# EAGLE design E-Reader (EAGLE 9.7.0)
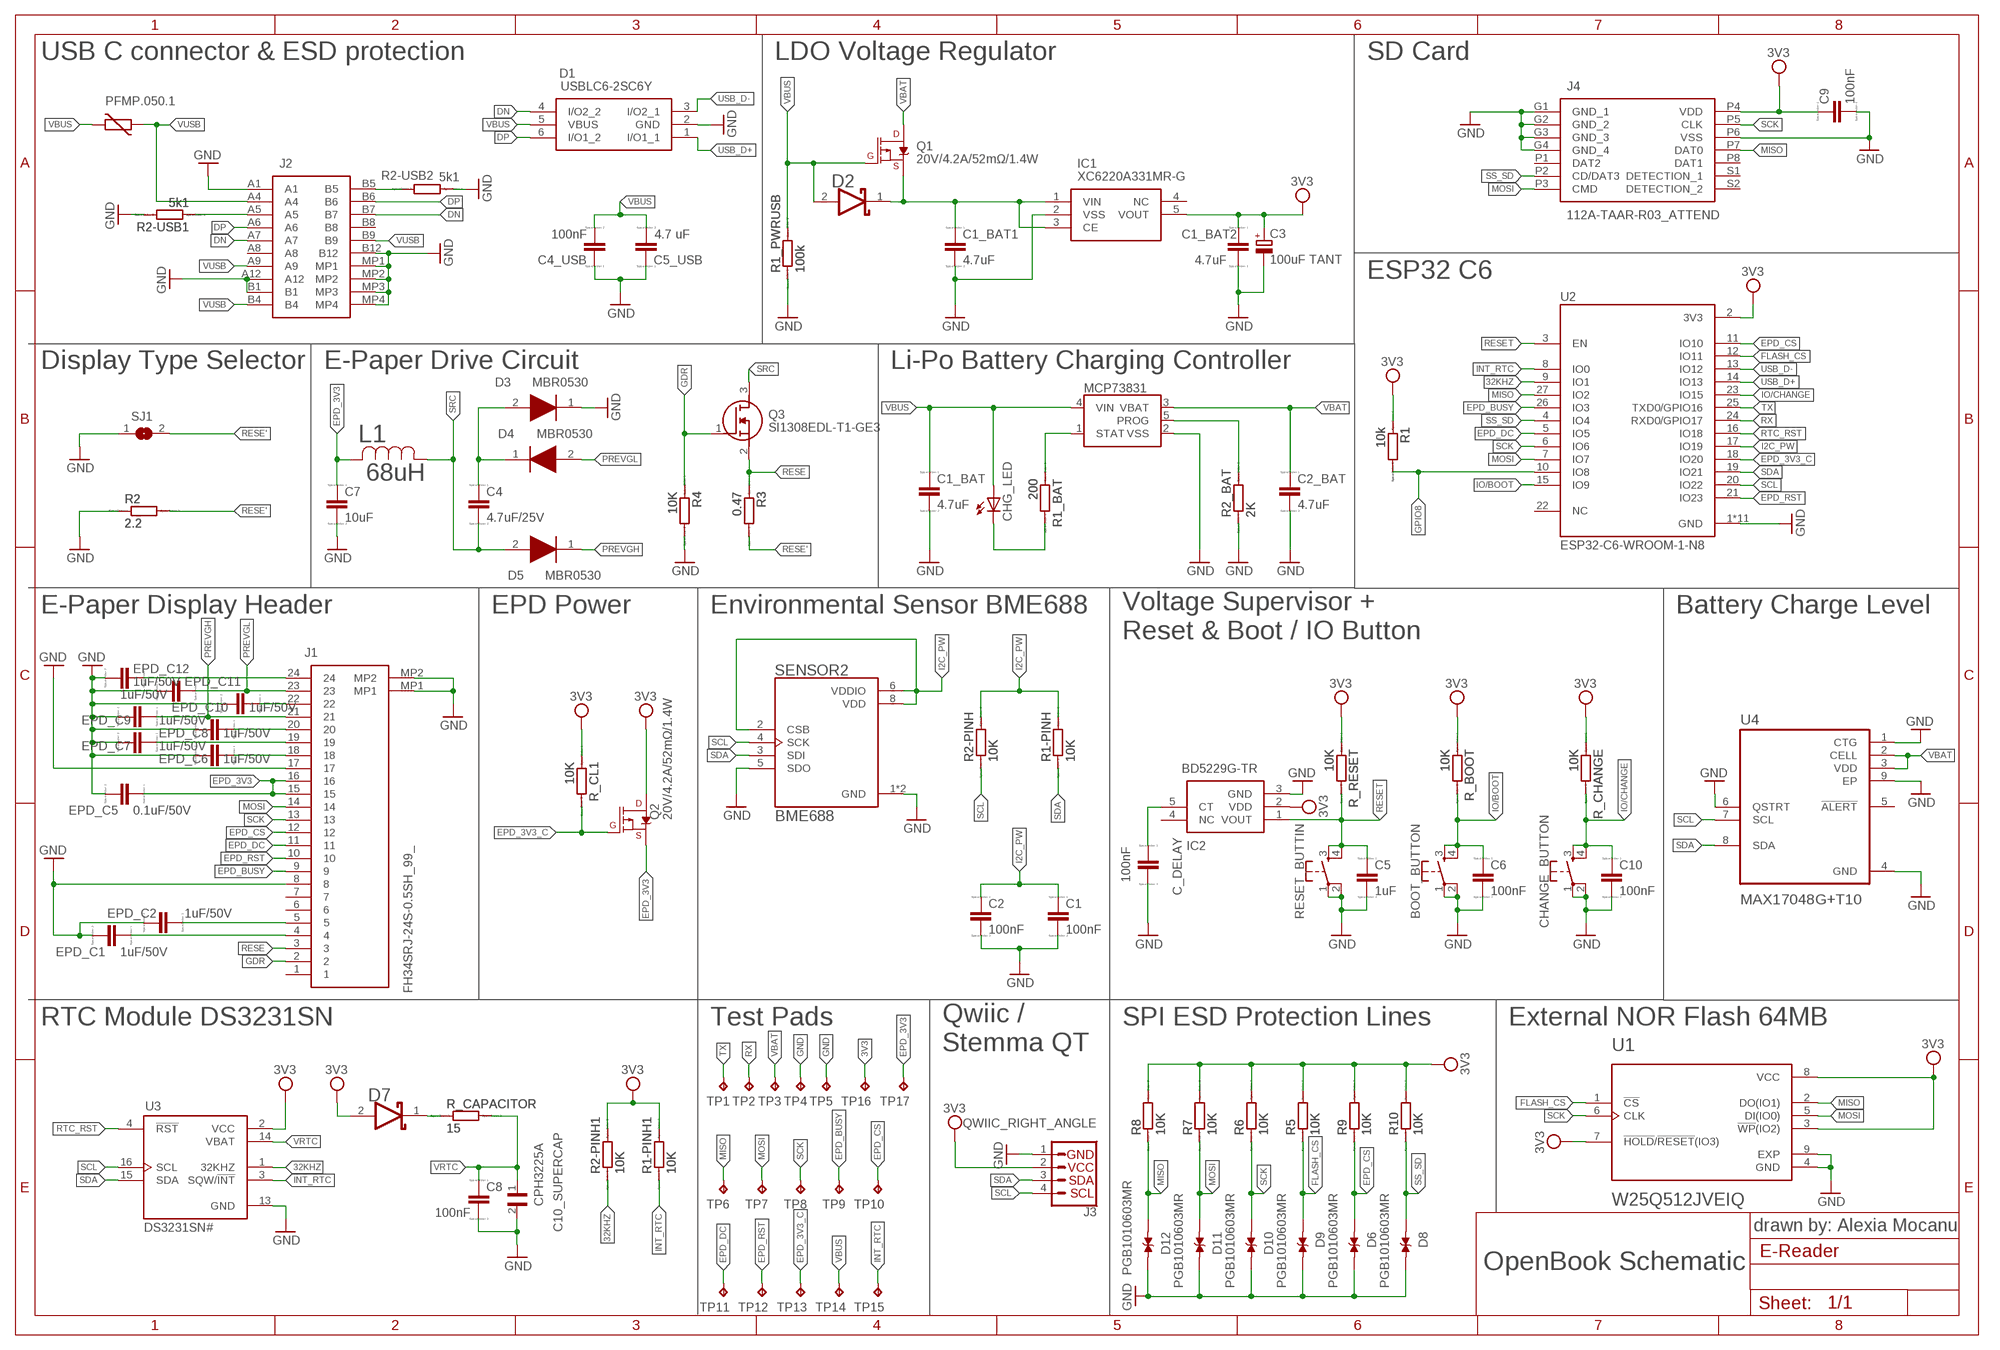
[diagram p0: schematic, sheet 1]

## Parts
BOOT_BUTTON  BUTTON_CUSYOMV1  [MYBUTTON]
C1  100nF  EAGLE-LTSPICE_CC0402  [EAGLE-LTSPICE_C0402]
C1_BAT  4.7uF  EAGLE-LTSPICE_CC0402  [EAGLE-LTSPICE_C0402]
C1_BAT1  4.7uF  EAGLE-LTSPICE_CC0402  [EAGLE-LTSPICE_C0402]
C1_BAT2  4.7uF  EAGLE-LTSPICE_CC0402  [EAGLE-LTSPICE_C0402]
C2  100nF  EAGLE-LTSPICE_CC0402  [EAGLE-LTSPICE_C0402]
C2_BAT  4.7uF  EAGLE-LTSPICE_CC0402  [EAGLE-LTSPICE_C0402]
C3  100uF TANT  RCL_CPOL-EUCT3528  [RCL_CT3528]
C4  4.7uF/25V  EAGLE-LTSPICE_CC0402  [EAGLE-LTSPICE_C0402]
C4_USB  100nF  EAGLE-LTSPICE_CC0402  [EAGLE-LTSPICE_C0402]
C5  1uF  EAGLE-LTSPICE_CC0402  [EAGLE-LTSPICE_C0402]
C5_USB  4.7 uF  EAGLE-LTSPICE_CC0402  [EAGLE-LTSPICE_C0402]
C6  100nF  EAGLE-LTSPICE_CC0402  [EAGLE-LTSPICE_C0402]
C7  10uF  EAGLE-LTSPICE_CC0402  [EAGLE-LTSPICE_C0402]
C8  100nF  EAGLE-LTSPICE_CC0402  [EAGLE-LTSPICE_C0402]
C9  100nF  EAGLE-LTSPICE_CC0402  [EAGLE-LTSPICE_C0402]
C10  100nF  EAGLE-LTSPICE_CC0402  [EAGLE-LTSPICE_C0402]
C10_SUPERCAP  CPH3225A  [CAPCP3225X100N]
C_DELAY  100nF  EAGLE-LTSPICE_CC0402  [EAGLE-LTSPICE_C0402]
CHANGE_BUTTON  BUTTON_CUSYOMV1  [MYBUTTON]
CHG_LED  ADAFRUIT_LEDCHIP-LED0603  [ADAFRUIT_CHIP-LED0603]
D1  USBLC6-2SC6Y  [SOT95P280X145-6N]
D2  ESP32_WROVER_AVX---SD0805S020S1R0_AVX_SD0805S020S1R0_0_0AVX_SD0805S020S1R0_0_0  [ESP32_WROVER_AVX---SD0805S020S1R0_AVX_SD0805S020S1R0_0]
D3  MBR0530  [SOD3716X135N]
D4  MBR0530  [SOD3716X135N]
D5  MBR0530  [SOD3716X135N]
D6  PGB1010603MR  [DIOC1608X36N]
D7  SD0805S020S1R0  ESP32_WROVER_AVX---SD0805S020S1R0_AVX_SD0805S020S1R0_0_0AVX_SD0805S020S1R0_0_0  [ESP32_WROVER_AVX---SD0805S020S1R0_AVX_SD0805S020S1R0_0]
D8  PGB1010603MR  [DIOC1608X36N]
D9  PGB1010603MR  [DIOC1608X36N]
D10  PGB1010603MR  [DIOC1608X36N]
D11  PGB1010603MR  [DIOC1608X36N]
D12  PGB1010603MR  [DIOC1608X36N]
EPD_C1  1uF/50V  EAGLE-LTSPICE_CC0402  [EAGLE-LTSPICE_C0402]
EPD_C2  1uF/50V  EAGLE-LTSPICE_CC0402  [EAGLE-LTSPICE_C0402]
EPD_C5  0.1uF/50V  EAGLE-LTSPICE_CC0402  [EAGLE-LTSPICE_C0402]
EPD_C6  1uF/50V  EAGLE-LTSPICE_CC0402  [EAGLE-LTSPICE_C0402]
EPD_C7  1uF/50V  EAGLE-LTSPICE_CC0402  [EAGLE-LTSPICE_C0402]
EPD_C8  1uF/50V  EAGLE-LTSPICE_CC0402  [EAGLE-LTSPICE_C0402]
EPD_C9  1uF/50V  EAGLE-LTSPICE_CC0402  [EAGLE-LTSPICE_C0402]
EPD_C10  1uF/50V  EAGLE-LTSPICE_CC0402  [EAGLE-LTSPICE_C0402]
EPD_C11  1uF/50V  EAGLE-LTSPICE_CC0402  [EAGLE-LTSPICE_C0402]
EPD_C12  1uF/50V  EAGLE-LTSPICE_CC0402  [EAGLE-LTSPICE_C0402]
IC1  XC6220A331MR-G  [SOT95P280X120-5N]
IC2  BD5229G-TR  [SOT95P280X125-5N]
J1  FH34SRJ-24S-0.5SH_99_  [FH34SRJ24S05SH99]
J2  SAMACSYS_PARTS_USB4110-GF-A  [SAMACSYS_PARTS_USB4110GFA]
J3  QWIIC_RIGHT_ANGLE  QWIIC_CONNECTORJS-1MM  [JST04_1MM_RA]
J4  112A-TAAR-R03_ATTEND  [112ATAARR03ATTEND]
L1  68uH  744043680IND_4828-WE-TPC_WRE  [IND_4828-WE-TPC_WRE]
MCP73831  ESP32_WROVER_SPARKFUN-IC-POWER_MCP73831  [ESP32_WROVER_SPARKFUN-IC-POWER_SOT23-5]
PFMP.050.1  ESP32C6_VARISTORCN1812  [ESP32C6_VARISTOR_CT/CN1812]
Q1  20V/4.2A/52mΩ/1.4W  ESP32_WROVER_SPARKFUN-DISCRETESEMI_MOSFET_PCH-DMG2305UX-7  [ESP32_WROVER_SPARKFUN-DISCRETESEMI_SOT23-3]
Q2  20V/4.2A/52mΩ/1.4W  ESP32_WROVER_SPARKFUN-DISCRETESEMI_MOSFET_PCH-DMG2305UX-7  [ESP32_WROVER_SPARKFUN-DISCRETESEMI_SOT23-3]
Q3  SI1308EDL-T1-GE3  [SOT65P210X110-3N]
R1  10k  ESP32_WROVER_EAGLE-LTSPICE_RR0402  [ESP32_WROVER_EAGLE-LTSPICE_R0402]
R1-PINH  10K  ESP32_WROVER_EAGLE-LTSPICE_RR0402  [ESP32_WROVER_EAGLE-LTSPICE_R0402]
R1-PINH1  10K  ESP32_WROVER_EAGLE-LTSPICE_RR0402  [ESP32_WROVER_EAGLE-LTSPICE_R0402]
R1_BAT  200  ESP32_WROVER_EAGLE-LTSPICE_RR0402  [ESP32_WROVER_EAGLE-LTSPICE_R0402]
R1_PWRUSB  100k  ESP32_WROVER_EAGLE-LTSPICE_RR0402  [ESP32_WROVER_EAGLE-LTSPICE_R0402]
R2  2.2  ESP32_WROVER_EAGLE-LTSPICE_RR0402  [ESP32_WROVER_EAGLE-LTSPICE_R0402]
R2-PINH  10K  ESP32_WROVER_EAGLE-LTSPICE_RR0402  [ESP32_WROVER_EAGLE-LTSPICE_R0402]
R2-PINH1  10K  ESP32_WROVER_EAGLE-LTSPICE_RR0402  [ESP32_WROVER_EAGLE-LTSPICE_R0402]
R2-USB1  5k1  ESP32_WROVER_EAGLE-LTSPICE_RR0402  [ESP32_WROVER_EAGLE-LTSPICE_R0402]
R2-USB2  5k1  ESP32_WROVER_EAGLE-LTSPICE_RR0402  [ESP32_WROVER_EAGLE-LTSPICE_R0402]
R2_BAT  2K  ESP32_WROVER_EAGLE-LTSPICE_RR0402  [ESP32_WROVER_EAGLE-LTSPICE_R0402]
R3  0.47  ESP32_WROVER_EAGLE-LTSPICE_RR0402  [ESP32_WROVER_EAGLE-LTSPICE_R0402]
R4  10K  ESP32_WROVER_EAGLE-LTSPICE_RR0402  [ESP32_WROVER_EAGLE-LTSPICE_R0402]
R5  10K  ESP32_WROVER_EAGLE-LTSPICE_RR0402  [ESP32_WROVER_EAGLE-LTSPICE_R0402]
R6  10K  ESP32_WROVER_EAGLE-LTSPICE_RR0402  [ESP32_WROVER_EAGLE-LTSPICE_R0402]
R7  10K  ESP32_WROVER_EAGLE-LTSPICE_RR0402  [ESP32_WROVER_EAGLE-LTSPICE_R0402]
R8  10K  ESP32_WROVER_EAGLE-LTSPICE_RR0402  [ESP32_WROVER_EAGLE-LTSPICE_R0402]
R9  10K  ESP32_WROVER_EAGLE-LTSPICE_RR0402  [ESP32_WROVER_EAGLE-LTSPICE_R0402]
R10  10K  ESP32_WROVER_EAGLE-LTSPICE_RR0402  [ESP32_WROVER_EAGLE-LTSPICE_R0402]
R_BOOT  10K  ESP32_WROVER_EAGLE-LTSPICE_RR0402  [ESP32_WROVER_EAGLE-LTSPICE_R0402]
R_CAPACITOR  15  ESP32_WROVER_EAGLE-LTSPICE_RR0402  [ESP32_WROVER_EAGLE-LTSPICE_R0402]
R_CHANGE  10K  ESP32_WROVER_EAGLE-LTSPICE_RR0402  [ESP32_WROVER_EAGLE-LTSPICE_R0402]
R_CL1  10K  ESP32_WROVER_EAGLE-LTSPICE_RR0402  [ESP32_WROVER_EAGLE-LTSPICE_R0402]
R_RESET  10K  ESP32_WROVER_EAGLE-LTSPICE_RR0402  [ESP32_WROVER_EAGLE-LTSPICE_R0402]
RESET_BUTTIN  BUTTON_CUSYOMV1  [MYBUTTON]
SENSOR2  BME688  ESP32_WROVER_BME680_BME680  [ESP32_WROVER_BME680_PSON80P300X300X100-8N]
SJ1  SJ  [SJ]
TP1  TPTP20R  [TP20R]
TP2  TPTP20R  [TP20R]
TP3  TPTP20R  [TP20R]
TP4  TPTP20R  [TP20R]
TP5  TPTP20R  [TP20R]
TP6  TPTP20R  [TP20R]
TP7  TPTP20R  [TP20R]
TP8  TPTP20R  [TP20R]
TP9  TPTP20R  [TP20R]
TP10  TPTP20R  [TP20R]
TP11  TPTP20R  [TP20R]
TP12  TPTP20R  [TP20R]
TP13  TPTP20R  [TP20R]
TP14  TPTP20R  [TP20R]
TP15  TPTP20R  [TP20R]
TP16  TPTP20R  [TP20R]
TP17  TPTP20R  [TP20R]
U1  W25Q512JVEIQ  [SON127P600X800X80-9N]
U2  ESP32-C6-WROOM-1-N8  [XCVR_ESP32-C6-WROOM-1-N8]
U3  DS3231SN#  [SOIC127P1032X265-16N]
U4  MAX17048G+T10  [SON50P200X200X80-9N]

## Nets
3V3 [power]: C1_BAT2.1 C3.+ C9.1 D7.2(ANODE) IC1.5(VOUT) IC2.2(VDD) J3.2 J4.P4(VDD) Q2.3(D) R1-PINH1.2 R1.1 R2-PINH1.2 R5.2 R6.2 R7.2 R8.2 R9.2 R10.2 R_BOOT.1 R_CHANGE.1 R_CL1.1 R_RESET.1 TP16.TP U1.3(!WP!(IO2)) U1.7(!HOLD!/!RESET!(IO3)) U1.8(VCC) U2.2(3V3) U3.2(VCC)
32KHZ: R2-PINH1.1 U2.9(IO1) U3.1(32KHZ)
DN: D1.4(I/O2_2) J2.A7 J2.B7
DP: D1.6(I/O1_2) J2.A6 J2.B6
EPD_3V3 [power]: C7.1 EPD_C5.1 J1.15 J1.16 L1.2 Q2.2(S) TP17.TP
EPD_3V3_C [power]: Q2.1(G) R_CL1.2 TP13.TP U2.18(IO20)
EPD_BUSY: J1.9 TP9.TP U2.26(IO3)
EPD_CS: D6.1 J1.12 R9.1 TP10.TP U2.11(IO10)
EPD_DC: J1.11 TP11.TP U2.5(IO5)
EPD_RST: J1.10 TP12.TP U2.21(IO23)
FLASH_CS: D9.1 R5.1 U1.1(!CS) U2.12(IO11)
GDR: J1.2 Q3.1(G) R4.1
GND: BOOT_BUTTON.1 BOOT_BUTTON.2 C1.2 C1_BAT1.2 C1_BAT2.2 C1_BAT.2 C2.2 C2_BAT.2 C3.- C4_USB.1 C5.2 C5_USB.1 C6.2 C7.2 C8.2 C9.2 C10.2 C10_SUPERCAP.2 C_DELAY.2 CHANGE_BUTTON.1 CHANGE_BUTTON.2 D1.2(GND) D3.1(K) D6.2 D8.2 D9.2 D10.2 D11.2 D12.2 EPD_C1.2 EPD_C2.2 EPD_C5.2 EPD_C6.2 EPD_C7.2 EPD_C8.2 EPD_C9.2 EPD_C10.2 EPD_C11.2 EPD_C12.2 IC1.2(VSS) IC2.3(GND) J1.8 J1.17 J1.MP1 J1.MP2 J2.A1 J2.A12 J2.B1 J2.B12 J2.MP1 J2.MP2 J2.MP3 J2.MP4 J3.1 J4.G1(GND_1) J4.G2(GND_2) J4.G3(GND_3) J4.G4(GND_4) J4.P6(VSS) MCP73831.2(VSS) R1_PWRUSB.1 R2-USB1.2 R2-USB2.1 R2.1 R2_BAT.1 R4.2 RESET_BUTTIN.1 RESET_BUTTIN.2 SENSOR2.1(GND) SENSOR2.5(SDO) SENSOR2.7(GND) SJ1.1 TP4.TP TP5.TP U1.4(GND) U1.9(EXP) U2.1(GND) U2.28(GND) U2.29_1(GND) U2.29_2(GND) U2.29_3(GND) U2.29_4(GND) U2.29_5(GND) U2.29_6(GND) U2.29_7(GND) U2.29_8(GND) U2.29_9(GND) U3.13(GND) U4.1(CTG) U4.4(GND) U4.6(QSTRT) U4.9(EP)
GPIO8: R1.2 U2.10(IO8)
I2C_PW [power]: C1.1 C2.1 R1-PINH.2 R2-PINH.2 SENSOR2.2(CSB) SENSOR2.6(VDDIO) SENSOR2.8(VDD) U2.17(IO19)
INT_RTC: R1-PINH1.1 TP15.TP U2.8(IO0) U3.3(SQW/!INT)
IO/BOOT: BOOT_BUTTON.3 BOOT_BUTTON.4 C6.1 R_BOOT.2 U2.15(IO9)
IO/CHANGE: C10.1 CHANGE_BUTTON.3 CHANGE_BUTTON.4 R_CHANGE.2 U2.23(IO15)
MISO: D12.1 J4.P7(DAT0) R8.1 TP6.TP U1.2(DO(IO1)) U2.27(IO2)
MOSI: D11.1 J1.14 J4.P3(CMD) R7.1 TP7.TP U1.5(DI(IO0)) U2.7(IO7)
N$1: C1_BAT1.1 D2.1(CATHODE) IC1.1(VIN) IC1.3(CE) Q1.2(S)
N$2: J2.A5 R2-USB1.1
N$3: EPD_C12.1 J1.24
N$4: C_DELAY.1 IC2.5(CT)
N$5: C4.1 D3.2(A) D4.1(K)
N$6: MCP73831.1(STAT) R1_BAT.1
N$7: CHG_LED.C R1_BAT.2
N$8: J2.B5 R2-USB2.2
N$9: MCP73831.5(PROG) R2_BAT.2
N$10: EPD_C10.1 J1.22
N$12: EPD_C8.1 J1.20
N$13: EPD_C7.1 J1.19
N$14: EPD_C6.1 J1.18
N$16: EPD_C1.1 J1.4
N$17: EPD_C2.1 J1.5
N$22: D7.1(CATHODE) R_CAPACITOR.1
PREVGH: D5.1(K) EPD_C9.1 J1.21
PREVGL: D4.2(A) EPD_C11.1 J1.23
RESE: J1.3 Q3.2(S) R3.1
RESE': R2.2 R3.2 SJ1.2
RESET: C5.1 IC2.1(VOUT) R_RESET.2 RESET_BUTTIN.3 RESET_BUTTIN.4 U2.3(EN)
RTC_RST: U2.16(IO18) U3.4(!RST)
RX: TP2.TP U2.24(RXD0/GPIO17)
SCK: D10.1 J1.13 J4.P5(CLK) R6.1 TP8.TP U1.6(CLK) U2.6(IO6)
SCL: J3.4 R2-PINH.1 SENSOR2.4(SCK) U2.20(IO22) U3.16(SCL) U4.7(SCL)
SDA: J3.3 R1-PINH.1 SENSOR2.3(SDI) U2.19(IO21) U3.15(SDA) U4.8(SDA)
SRC: C4.2 D5.2(A) L1.1 Q3.3(D)
SS_SD: D8.1 J4.P2(CD/DAT3) R10.1 U2.4(IO4)
TX: TP1.TP U2.25(TXD0/GPIO16)
USB_D+: D1.1(I/O1_1) U2.14(IO13)
USB_D-: D1.3(I/O2_1) U2.13(IO12)
VBAT [power]: C2_BAT.1 MCP73831.3(VBAT) Q1.3(D) TP3.TP U4.2(CELL) U4.3(VDD)
VBUS [power]: C1_BAT.1 C4_USB.2 C5_USB.2 CHG_LED.A D1.5(VBUS) D2.2(ANODE) MCP73831.4(VIN) PFMP.050.1.2 Q1.1(G) R1_PWRUSB.2 TP14.TP
VRTC: C8.1 C10_SUPERCAP.1 R_CAPACITOR.2 U3.14(VBAT)
VUSB [power]: J2.A4 J2.A9 J2.B4 J2.B9 PFMP.050.1.1
Unconnected: IC1.4(NC) IC2.4(NC) J1.1 J1.6 J1.7 J2.A8 J2.B8 J4.P1(DAT2) J4.P8(DAT1) J4.S1(DETECTION_1) J4.S2(DETECTION_2) U2.22(NC) U4.5(!ALERT)

## Notes on the sheet
- USB C connector & ESD protection | LDO Voltage Regulator | SD Card
- ESP32 C6
- Display Type Selector | E-Paper Drive Circuit | Li-Po Battery Charging Controller
- E-Paper Display Header | EPD Power | Environmental Sensor BME688 | Battery Charge Level
- Voltage Supervisor +
  Reset & Boot / IO Button
- RTC Module DS3231SN | Test Pads | SPI ESD Protection Lines | External NOR Flash 64MB
- Qwiic /
  Stemma QT
- drawn by: Alexia Mocanu
- OpenBook Schematic

## Library data of the parts
BOOT_BUTTON CHANGE_BUTTON RESET_BUTTIN = DeskAssistant v19 v1.flbr:BUTTON_CUSYOMV1
C1 C1_BAT C1_BAT1 C1_BAT2 C2 C2_BAT C4 C4_USB C5 C5_USB C6-C10 C_DELAY EPD_C1 EPD_C2 EPD_C5-EPD_C12 = DeskAssistant v19 v1.flbr:EAGLE-LTSPICE_C: CAPACITOR, European symbol; SPICEMODEL: NONE; SPICEPREFIX: C
C3 = DeskAssistant v19 v1.flbr:RCL_CPOL-EU: POLARIZED CAPACITOR, European symbol; SPICEPREFIX: C
C10_SUPERCAP = DeskAssistant v19 v1.flbr:CPH3225A: Cap 0.011F 3.3V 1210 Flat Check availability <https://pricing.snapeda.com/parts/CPH3225A/Seiko%20Instruments/view-part?ref=eda>; AVAILABILITY: Not in stock; CHECK_PRICES: https://www.snapeda.com/parts/CPH3225A/Seiko+Instruments/view-part/?ref=eda; DESCRIPTION: 11 mF (EDLC) Supercapacitor 3.3 V 1210 (3225 Metric) - -; MF: Seiko Instruments; MP: CPH3225A; PACKAGE: 1210 Seiko; PRICE: None; PURCHASE-URL: https://www.snapeda.com/api/url_track_click_mouser/?unipart_id=562593&manufacturer=Seiko Instruments&part_name=CPH3225A&search_term=None; SNAPEDA_LINK: https://www.snapeda.com/parts/CPH3225A/Seiko+Instruments/view-part/?ref=snap
CHG_LED = DeskAssistant v19 v1.flbr:ADAFRUIT_LED: LED OSRAM: - CHIPLED LG R971, LG N971, LY N971, LG Q971, LY Q971, LO R971, LY R971 LH N974, LH R974 LS Q976, LO Q976, LY Q976 LO Q996 - Hyper CHIPLED LW Q18S LB Q993, LB Q99A, LB R99A - SideLED LS A670, LO A670, LY A670, LG A670, LP A670 LB A673, LV A673, LT A673, LW A673 LH A674 LY A675 LS A676, LA A676, LO A676, LY A676, LW A676 LS A679, LY A679, LG A679 - Hyper Micro SIDELED® LS Y876, LA Y876, LO Y876, LY Y876 LT Y87S - SmartLED LW L88C, LW L88S LB L89C, LB L89S, LG L890 LS L89K, LO L89K, LY L89K LS L896, LA L896, LO L896, LY L896 - TOPLED LS T670, LO T670, LY T670, LG T670, LP T670 LSG T670, LSP T670, LSY T670, LOP T670, LYG T670 LG T671, LOG T671, LSG T671 LB T673, LV T673, LT T673, LW T673 LH T674 LS T676, LA T676, LO T676, LY T676, LB T676, LH T676, LSB T676, LW T676 LB T67C, LV T67C, LT T67C, LS T67K, LO T67K, LY T67K, LW E67C LS E67B, LA E67B, LO E67B, LY E67B, LB E67C, LV E67C, LT E67C LW T67C LS T679, LY T679, LG T679 LS T770, LO T770, LY T770, LG T770, LP T770 LB T773, LV T773, LT T773, LW T773 LH T774 LS E675, LA E675, LY E675, LS T675 LS T776, LA T776, LO T776, LY T776, LB T776 LHGB T686 LT T68C, LB T68C - Hyper Mini TOPLED® LB M676 - Mini TOPLED Santana® LG M470 LS M47K, LO M47K, LY M47K Source: http://www.osram.convergy.de/
D1 = DeskAssistant v19 v1.flbr:USBLC6-2SC6Y: Low Cap. ESD Protection Auto SOT-23-6 STMicroelectronics USBLC6-2SC6Y, Dual Uni-Directional TVS Diode Array, 6-Pin SOT-23 Source: Datasheet <https://componentsearchengine.com/Datasheets/1/USBLC6-2SC6Y.pdf> Check availability <https://pricing.snapeda.com/parts/USBLC6-2SC6Y/STMicroelectronics/view-part?ref=eda>; AVAILABILITY: In Stock; CHECK_PRICES: https://www.snapeda.com/parts/USBLC6-2SC6Y/STMicroelectronics/view-part/?ref=eda; DESCRIPTION: 17V Clamp 5A (8/20µs) Ipp Tvs Diode Surface Mount SOT-23-6; MF: STMicroelectronics; MP: USBLC6-2SC6Y; PACKAGE: SOT-23-6 STMicroelectronics; PRICE: None; SNAPEDA_LINK: https://www.snapeda.com/parts/USBLC6-2SC6Y/STMicroelectronics/view-part/?ref=snap
D2 D7 = DeskAssistant v19 v1.flbr:ESP32_WROVER_AVX---SD0805S020S1R0_AVX_SD0805S020S1R0_0_0: Schottky Barrier Rectifier Diode; CENTROID_NOT_SPECIFIED: No; DATASHEET: http://datasheets.avx.com/schottky.pdf; DIGIKEY_DESCRIPTION: DIODE SCHOTTKY 20V 1A 0805; DIGIKEY_PART_NUMBER: 478-7800-1-ND; LEAD_FREE: yes; MF: AVX; MOUSER_PART_NUMBER: 581-SD0805S020S1R0; PACKAGE: 0805 (2012 metric); PREFIX: D; ROHS: yes; TEMPERATURE_RANGE_HIGH: +125°C; TEMPERATURE_RANGE_LOW: -55°C
D3-D5 = DeskAssistant v19 v1.flbr:MBR0530: ON SEMICONDUCTOR - MBR0530 - DIODE, SCHOTTKY, 0.5A, 30V, SOD-123 Source: Datasheet <http://www.onsemi.com/pub/Collateral/MBR0530T1-D.PDF> Check availability <https://pricing.snapeda.com/parts/MBR0530/ON%20Semiconductor/view-part?ref=eda>; AVAILABILITY: In Stock; CHECK_PRICES: https://www.snapeda.com/parts/MBR0530/Onsemi/view-part/?ref=eda; DESCRIPTION: Diode Schottky 30 V 500mA Surface Mount SOD-123; MF: ON Semiconductor; MP: MBR0530; PACKAGE: SOD-123-2 ON Semiconductor; PRICE: None; PURCHASE-URL: https://www.snapeda.com/api/url_track_click_mouser/?unipart_id=179458&manufacturer=ON Semiconductor&part_name=MBR0530&search_term=None; SNAPEDA_LINK: https://www.snapeda.com/parts/MBR0530/Onsemi/view-part/?ref=snap
D6 D8-D12 = DeskAssistant v19 v1.flbr:PGB1010603MR: Check availability <https://pricing.snapeda.com/parts/PGB1010603MR/Littelfuse%20Inc./view-part?ref=eda>; AVAILABILITY: In Stock; CHECK_PRICES: https://www.snapeda.com/parts/PGB1010603MR/Littelfuse/view-part/?ref=eda; DESCRIPTION: 150V (Typ) Clamp - Ipp Tvs Diode Surface Mount 0603 (1608 Metric); MF: Littelfuse Inc.; MP: PGB1010603MR; PACKAGE: 0603 Littelfuse Inc.; PRICE: None; PURCHASE-URL: https://www.snapeda.com/api/url_track_click_mouser/?unipart_id=5659453&manufacturer=Littelfuse Inc.&part_name=PGB1010603MR&search_term=None; SNAPEDA_LINK: https://www.snapeda.com/parts/PGB1010603MR/Littelfuse/view-part/?ref=snap
IC1 = DeskAssistant v19 v1.flbr:XC6220A331MR-G: LDO Voltage Regulators Source: Datasheet <https://www.torexsemi.com/file/xc6220/XC6220.pdf>; DESCRIPTION: LDO Voltage Regulators; HEIGHT: 1.2mm; MANUFACTURER_NAME: Torex; MANUFACTURER_PART_NUMBER: XC6220A331MR-G; MOUSER_PART_NUMBER: 865-XC6220A331MR-G; MOUSER_PRICE-STOCK: https://www.mouser.co.uk/ProductDetail/Torex-Semiconductor/XC6220A331MR-G?qs=AsjdqWjXhJ8ZSWznL1J0gg%3D%3D
IC2 = DeskAssistant v19 v1.flbr:BD5229G-TR: Voltage Detector with Adjustable Delay Time: CMOS processes are utilized to develop high precision, low current consumption CMOS reset ICs that allow arbitrary setting of the delay time. The extensive lineup includes both Nch Open Drain and CMOS output types in a wide range of detection voltages (from 2.3V to 6.0V, in 0.1V steps), enabling selection of the ideal solution based on customer requirements. In addition, the entire series is of course both lead-free and RoHS-compliant. Source: Datasheet <https://datasheet.datasheetarchive.com/originals/distributors/Datasheets_SAMA/f2b9741ef86007909f138d561a359946.pdf>; DESCRIPTION: Voltage Detector with Adjustable Delay Time: CMOS processes are utilized to develop high precision, low current consumption CMOS reset ICs that allow arbitrary setting of the delay time. The extensive lineup includes both Nch Open Drain and CMOS output types in a wide range of detection voltages (from 2.3V to 6.0V, in 0.1V steps), enabling selection of the ideal solution based on customer requirements. In addition, the entire series is of course both lead-free and RoHS-compliant.; HEIGHT: 1.25mm; MANUFACTURER_NAME: ROHM Semiconductor; MANUFACTURER_PART_NUMBER: BD5229G-TR; MOUSER_PART_NUMBER: 755-BD5229G-TR; MOUSER_PRICE-STOCK: https://www.mouser.co.uk/ProductDetail/ROHM-Semiconductor/BD5229G-TR?qs=4kLU8WoGk0vvnhrrYwdszw%3D%3D
J1 = DeskAssistant v19 v1.flbr:FH34SRJ-24S-0.5SH_99_: 24 Position FFC, FPC Connector Contacts, Top and Bottom 0.020" (0.50mm) Surface Mount, Right Angle Source: Datasheet <https://www.hirose.com/en/product/document?clcode=CL0580-1255-6-99&productname=FH34SRJ-24S-0.5SH(99)&series=FH34SRJ&documenttype=2DDrawing&lang=en&documentid=0000990903>; DESCRIPTION: 24 Position FFC, FPC Connector Contacts, Top and Bottom 0.020" (0.50mm) Surface Mount, Right Angle; HEIGHT: 1.1mm; MANUFACTURER_NAME: Hirose; MANUFACTURER_PART_NUMBER: FH34SRJ-24S-0.5SH(99); MOUSER_PART_NUMBER: 798-FH34SRJ24S05SH99; MOUSER_PRICE-STOCK: https://www.mouser.co.uk/ProductDetail/Hirose-Connector/FH34SRJ-24S-0.5SH99?qs=vcbW%252B4%252BSTIpKBl5ap9J8Fw%3D%3D
J2 = DeskAssistant v19 v1.flbr:SAMACSYS_PARTS_USB4110-GF-A: CONN USB 2.0 TYPE-C R/A SMT Source: Datasheet <https://gct.co/files/drawings/usb4110.pdf>; DESCRIPTION: CONN USB 2.0 TYPE-C R/A SMT; HEIGHT: 3.26mm; MANUFACTURER_NAME: GCT (GLOBAL CONNECTOR TECHNOLOGY); MANUFACTURER_PART_NUMBER: USB4110-GF-A; MOUSER_PART_NUMBER: 640-USB4110-GF-A; MOUSER_PRICE-STOCK: https://www.mouser.co.uk/ProductDetail/GCT/USB4110-GF-A?qs=KUoIvG%2F9IlYiZvIXQjyJeA%3D%3D
J3 = DeskAssistant v19 v1.flbr:QWIIC_CONNECTOR: SparkFun I2C Standard Qwiic Connector An SMD 1mm pitch JST connector makes it easy and quick (get it? Qwiic?) to connect I2C devices to each other. The Qwiic system <http://www.sparkfun.com/qwiic> enables fast and solderless connection between popular platforms and various sensors and actuators. We carry 200mm <https://www.sparkfun.com/products/14204>, 100mm <https://www.sparkfun.com/products/14205>, 50mm <https://www.sparkfun.com/products/14206>, and breadboard friendly <https://www.sparkfun.com/products/14207> Qwiic cables. We also offer 10 pcs strips <https://www.sparkfun.com/products/14323> the SMD connectors.; PROD_ID: CONN-13694
J4 = DeskAssistant v19 v1.flbr:112A-TAAR-R03_ATTEND: Micro SD Card Socket, Push-Push Type, Top Mount, SMT, H=1.83mm, 10u Source: Datasheet <https://www.attend.com.tw/data/download/file/112A-TAAR-R03.pdf>; DESCRIPTION: Micro SD Card Socket, Push-Push Type, Top Mount, SMT, H=1.83mm, 10u; HEIGHT: 1.9mm; MANUFACTURER_NAME: ATTEND; MANUFACTURER_PART_NUMBER: 112A-TAAR-R03 ATTEND
L1 = DeskAssistant v19 v1.flbr:744043680; COPYRIGHT: Copyright (C) 2024 Ultra Librarian. All rights reserved.; MANUFACTURER_PART_NUMBER: 744043680; MFR_NAME: Wurth Electronics
MCP73831 = DeskAssistant v19 v1.flbr:ESP32_WROVER_SPARKFUN-IC-POWER_MCP73831: MCP73831T Li-Ion, Li-Pol Controller Miniature single cell, fully integrated Li-Ion, Li-polymer charge management controller Datasheet <http://ww1.microchip.com/downloads/en/DeviceDoc/20001984g.pdf> SparkFun Products: SparkFun ESP32 Thing <https://www.sparkfun.com/products/13907> SparkFun 9DoF Razor IMU M0 <https://www.sparkfun.com/products/14001>; PROD_ID: IC-09995
PFMP.050.1 = DeskAssistant v19 v1.flbr:ESP32C6_VARISTOR: VARISTOR
Q1 = DeskAssistant v19 v1.flbr:ESP32_WROVER_SPARKFUN-DISCRETESEMI_MOSFET_PCH: P-channel MOSFETs Voltage controlled devices that allow control of high current outputs. SparkFun Products: SparkFun ESP32 Thing <https://www.sparkfun.com/products/13907> SparkFun ESP8266 Thing <https://www.sparkfun.com/products/13231> SparkFun Pi Servo HAT V2 <https://www.sparkfun.com/products/15316> DMG2305UX-7 (20V/4.2A/SOT23-3); PROD_ID: TRAN-14388
Q2 = DeskAssistant v19 v1.flbr:ESP32_WROVER_SPARKFUN-DISCRETESEMI_MOSFET_PCH: P-channel MOSFETs Voltage controlled devices that allow control of high current outputs. SparkFun Products: SparkFun ESP32 Thing <https://www.sparkfun.com/products/13907> SparkFun ESP8266 Thing <https://www.sparkfun.com/products/13231> SparkFun Pi Servo HAT V2 <https://www.sparkfun.com/products/15316> DMG2305UX-7 (20V/4.2A/SOT23-3); PROD_ID: TRAN-14388; SPICEPREFIX: Q
Q3 = DeskAssistant v19 v1.flbr:SI1308EDL-T1-GE3: MOSFET N-Ch 30V 1.5A TrenchFET SC70 Vishay Si1308EDL-T1-GE3 N-channel MOSFET Transistor, 1.5 A, 30 V, 3-Pin SC-70 Source: Datasheet <https://componentsearchengine.com/Datasheets/1/SI1308EDL-T1-GE3.pdf> Check availability <https://pricing.snapeda.com/parts/SI1308EDL-T1-GE3/Vishay%20Siliconix/view-part?ref=eda>; AVAILABILITY: In Stock; CHECK_PRICES: https://www.snapeda.com/parts/SI1308EDL-T1-GE3/Vishay+Siliconix/view-part/?ref=eda; DESCRIPTION: Si1308EDL-T1-GE3 N-channel MOSFET Transistor, 1.5 A, 30 V, 3-Pin SC-70 | Siliconix / Vishay SI1308EDL-T1-GE3; MF: Vishay Siliconix; MP: SI1308EDL-T1-GE3; PACKAGE: SOT-323 Vishay Semiconductor; PRICE: None; PURCHASE-URL: https://www.snapeda.com/api/url_track_click_mouser/?unipart_id=274603&manufacturer=Vishay Siliconix&part_name=SI1308EDL-T1-GE3&search_term=None; SNAPEDA_LINK: https://www.snapeda.com/parts/SI1308EDL-T1-GE3/Vishay+Siliconix/view-part/?ref=snap
R1 R1-PINH R1-PINH1 R1_BAT R1_PWRUSB R2 R2-PINH R2-PINH1 R2-USB1 R2-USB2 R2_BAT R3-R10 R_BOOT R_CAPACITOR R_CHANGE R_CL1 R_RESET = DeskAssistant v19 v1.flbr:ESP32_WROVER_EAGLE-LTSPICE_R: RESISTOR, European symbol; SPICEMODEL: NONE; SPICEPREFIX: R
SENSOR2 = DeskAssistant v19 v1.flbr:ESP32_WROVER_BME680_BME680: Integrated Environmental Unit; AVAILABILITY: Unavailable; DESCRIPTION: Integrated Environmental Unit; MF: Bosch Sensortec; MP: BME680; PACKAGE: LGA-8 Bosch Tools; PRICE: None
SJ1 = DeskAssistant v19 v1.flbr:SJ: SMD solder JUMPER
TP1-TP17 = DeskAssistant v19 v1.flbr:TP: Test pad
U1 = DeskAssistant v19 v1.flbr:W25Q512JVEIQ: Check availability <https://pricing.snapeda.com/parts/W25Q512JVEIQ/Winbond%20Electronics/view-part?ref=eda>; AVAILABILITY: In Stock; CHECK_PRICES: https://www.snapeda.com/parts/W25Q512JVEIQ/Winbond+Electronics/view-part/?ref=eda; DESCRIPTION: FLASH - NOR Memory IC 512Mb (64M x 8) SPI - Quad I/O 133 MHz 8-WSON (8x6); MF: Winbond Electronics; MP: W25Q512JVEIQ; PACKAGE: Package; PRICE: None; SNAPEDA_LINK: https://www.snapeda.com/parts/W25Q512JVEIQ/Winbond+Electronics/view-part/?ref=snap
U2 = DeskAssistant v19 v1.flbr:ESP32-C6-WROOM-1-N8: Check availability <https://pricing.snapeda.com/parts/ESP32-C6-WROOM-1-N8/Espressif%20Systems/view-part?ref=eda>; AVAILABILITY: In Stock; CHECK_PRICES: https://www.snapeda.com/parts/ESP32-C6-WROOM-1-N8/Espressif+Systems/view-part/?ref=eda; DESCRIPTION: Multiprotocol Modules ESP32-C6 module, Wi-Fi 6 in 2.4 GHz band, Bluetooth 5, Zigbee 3.0 and Thread. ESP34-WROOM Compatible - ENGINEERING SAMPLE; MF: Espressif Systems; MP: ESP32-C6-WROOM-1-N8; PACKAGE: None; PRICE: None; SNAPEDA_LINK: https://www.snapeda.com/parts/ESP32-C6-WROOM-1-N8/Espressif+Systems/view-part/?ref=snap
U3 = DeskAssistant v19 v1.flbr:DS3231SN#: Real Time Clock Serial 16-Pin SOIC W T/R Check availability <https://pricing.snapeda.com/parts/DS3231SN%23/Analog%20Devices/view-part?ref=eda>; AVAILABILITY: In Stock; CHECK_PRICES: https://www.snapeda.com/parts/DS3231SN%23/Analog+Devices/view-part/?ref=eda; DESCRIPTION: Extremely Accurate I²C-Integrated RTC/TCXO/Crystal; MF: Analog Devices; MP: DS3231SN#; PACKAGE: SOIC-16 Maxim; PRICE: None; PURCHASE-URL: https://www.snapeda.com/api/url_track_click_mouser/?unipart_id=99048&manufacturer=Analog Devices&part_name=DS3231SN#&search_term=None; SNAPEDA_LINK: https://www.snapeda.com/parts/DS3231SN%23/Analog+Devices/view-part/?ref=snap
U4 = DeskAssistant v19 v1.flbr:MAX17048G+T10: Check availability <https://pricing.snapeda.com/parts/MAX17048G%2BT10/Analog%20Devices/view-part?ref=eda>; AVAILABILITY: In Stock; CHECK_PRICES: https://www.snapeda.com/parts/MAX17048G+T10/Analog+Devices/view-part/?ref=eda; DESCRIPTION: 3µA 1-Cell/2-Cell Fuel Gauge with ModelGauge; MF: Analog Devices; MP: MAX17048G+T10; PACKAGE: TDFN-8 Maxim; PRICE: None; PURCHASE-URL: https://www.snapeda.com/api/url_track_click_mouser/?unipart_id=329239&manufacturer=Analog Devices&part_name=MAX17048G+T10&search_term=None; SNAPEDA_LINK: https://www.snapeda.com/parts/MAX17048G+T10/Analog+Devices/view-part/?ref=snap

## Net classes
0 default: width 0.15 mm
2 power: width 0.3 mm

## Board
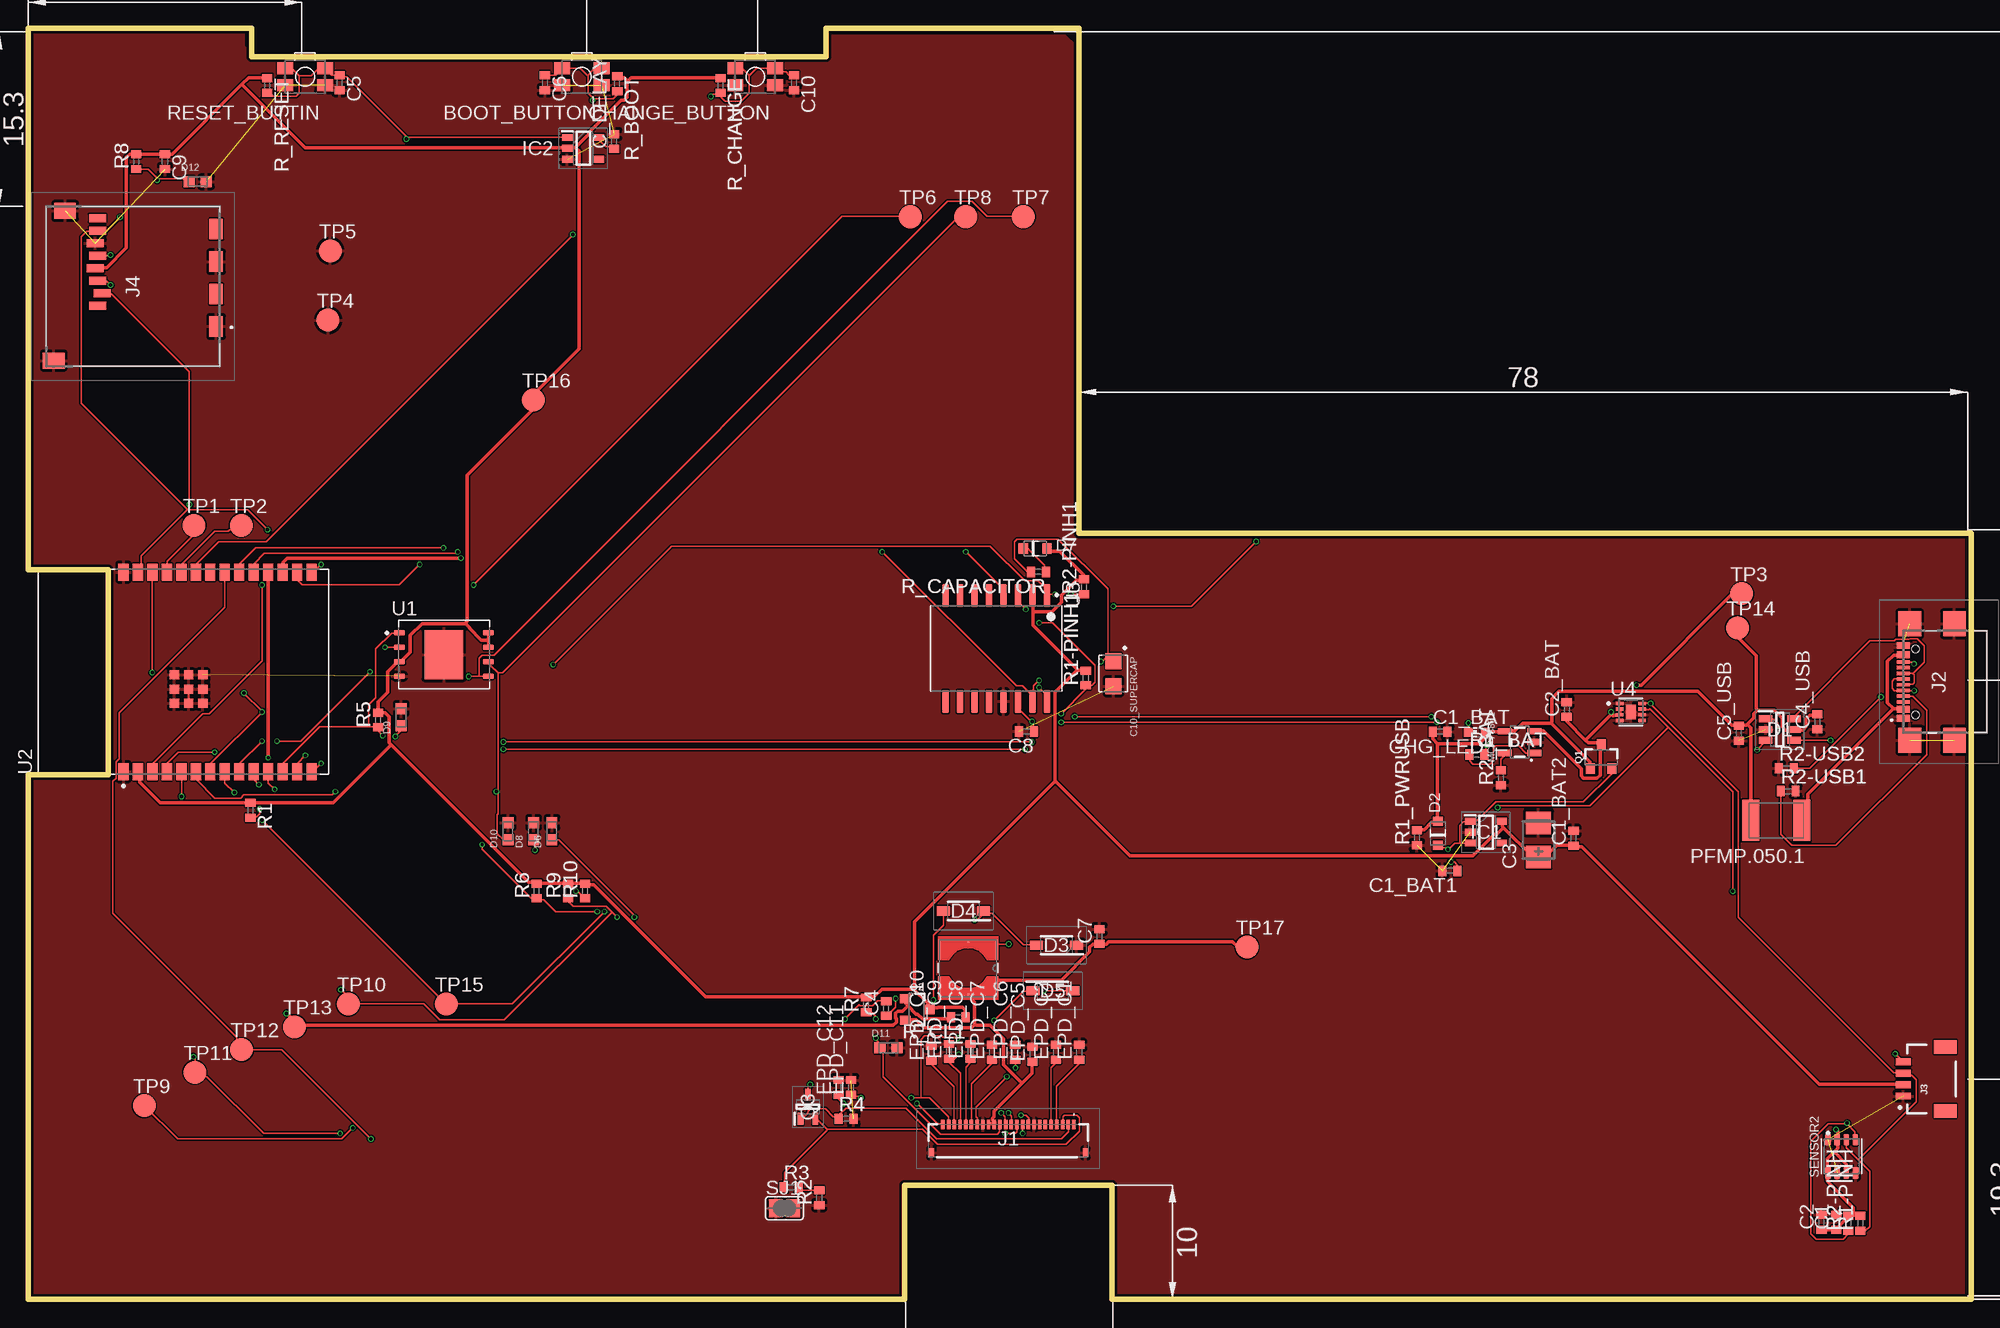
[diagram p1: board, top side]
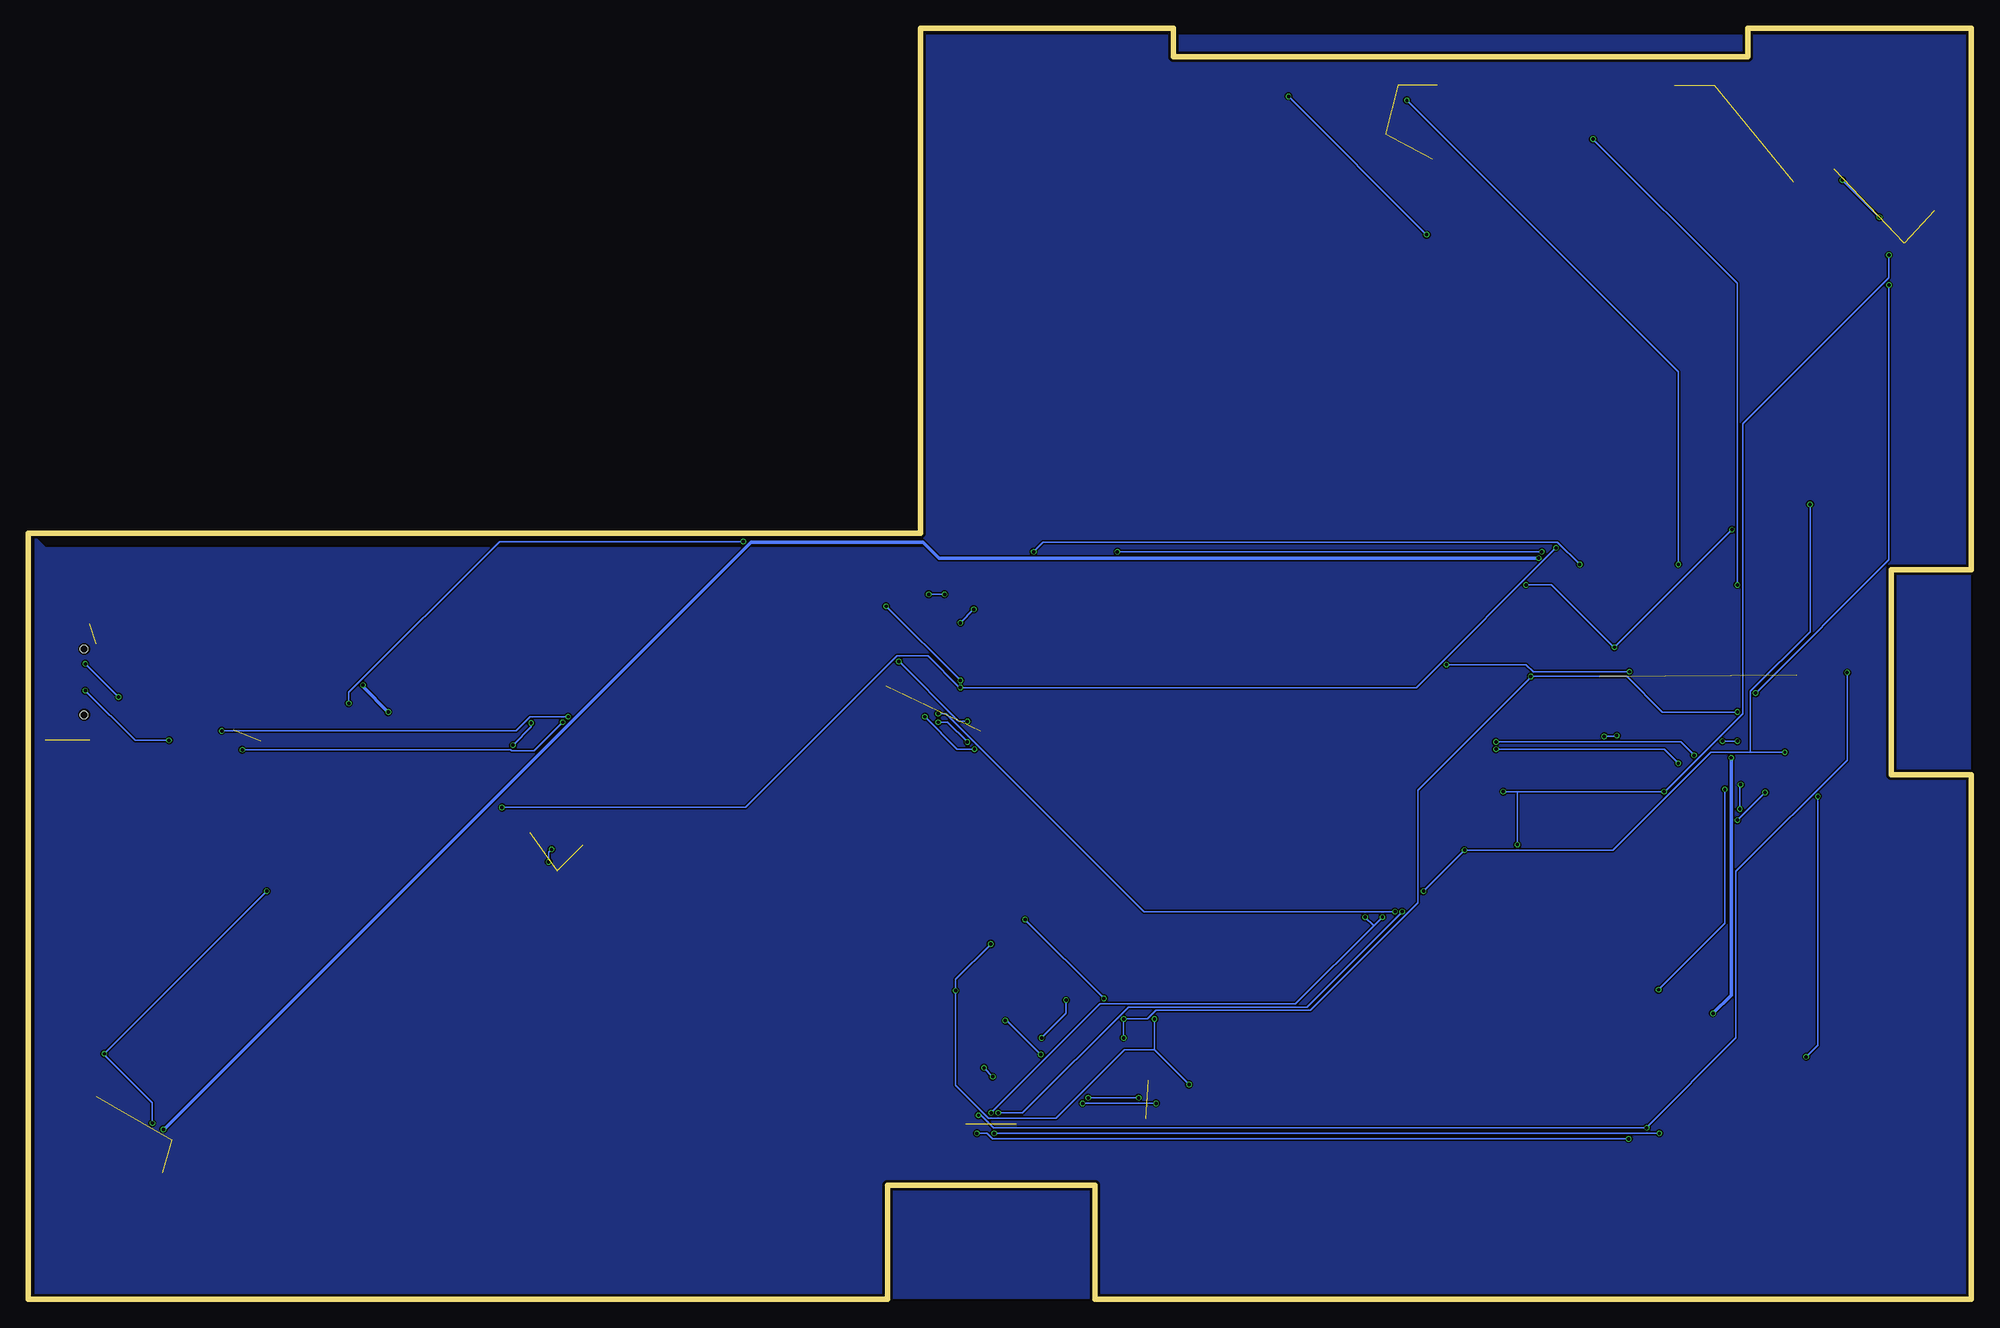
[diagram p2: board, bottom side, seen from below]

Size 170.5 x 111.5 mm. Coordinates in mm from the lower left corner, seen from the top.
Outline: 0,0 0,46 7,46 7,64 0,64 0,111.5 19.58,111.5 19.58,109 70,109 70,111.5 92.2,111.5 92.2,67.2 170.5,67.2 170.5,0 95.1,0 95.1,10 76.9,10 76.9,0 0,0
Copper layers (1*16): Top 0.035mm / dielectric 1.6mm / Bottom 0.035mm
Design rules "jlcpcb-2layers.dru": minimum track width 5mil, minimum drill 0.3mm, track to track 5mil, track to pad 5mil, pad to pad 5mil, via to via 5mil, smd to smd 5mil, copper to edge 0.2mm, drill to drill 6mil, minimum pad ring 10mil, minimum via ring 3mil, stop-mask expansion 4mil, vias tented up to drill 0mil, thermal gap 10mil

### Footprints (pad centres in the part's own frame; a part is rotated, then mirrored left to right if it is on the bottom)
MYBUTTON = smd 1.4 x 1.05: 1 1.75,0.75; 2 -1.75,0.75; 3 -1.75,-0.75; 4 1.75,-0.75
EAGLE-LTSPICE_C0402 = smd 0.7 x 0.9: 1 -0.65,0; 2 0.65,0
RCL_CT3528 = smd 2 x 2.2: + -1.5,0; - 1.5,0
CAPCP3225X100N = smd 1.4 x 1.4: 1 -1.1,0; 2 1.1,0
ADAFRUIT_CHIP-LED0603 = smd 0.8 x 0.8: A 0,-0.75; C 0,0.75
SOT95P280X145-6N = smd 1.2 x 0.6: 1 -1.25,0.95; 2 -1.25,0; 3 -1.25,-0.95; 4 1.25,-0.95; 5 1.25,0; 6 1.25,0.95
ESP32_WROVER_AVX---SD0805S020S1R0_AVX_SD0805S020S1R0_0 = smd 0.8 x 0.9: 1 -1.05,0; 2 1.05,0
SOD3716X135N = smd 1.15 x 0.8: 1 -1.75,0; 2 1.75,0
DIOC1608X36N = smd 0.97 x 0.94: 1 -0.75,0; 2 0.75,0
SOT95P280X120-5N = smd 0.9 x 0.6: 1 -1.4,0.95; 2 -1.4,0; 3 -1.4,-0.95; 4 1.4,-0.95; 5 1.4,0.95
SOT95P280X125-5N = smd 0.9 x 0.6: 1 -1.4,0.95; 2 -1.4,0; 3 -1.4,-0.95; 4 1.4,-0.95; 5 1.4,0.95
FH34SRJ24S05SH99 = smd 0.3 x 0.8: 1 5.75,1.45; 2 5.25,1.45; 3 4.75,1.45; 4 4.25,1.45; 5 3.75,1.45; 6 3.25,1.45; 7 2.75,1.45; 8 2.25,1.45; 9 1.75,1.45; 10 1.25,1.45; 11 0.75,1.45; 12 0.25,1.45; 13 -0.25,1.45; 14 -0.75,1.45; 15 -1.25,1.45; 16 -1.75,1.45; 17 -2.25,1.45; 18 -2.75,1.45; 19 -3.25,1.45; 20 -3.75,1.45; 21 -4.25,1.45; 22 -4.75,1.45; 23 -5.25,1.45; 24 -5.75,1.45 | smd 0.4 x 0.8: MP1 6.75,-1.05; MP2 -6.75,-1.05
SAMACSYS_PARTS_USB4110GFA = smd 0.3 x 1.15: A1 -3.35,3.678; A4 -2.55,3.678; A5 -1.25,3.678; A6 -0.25,3.678; A7 0.25,3.678; A8 1.25,3.678; A9 2.55,3.678; A12 3.35,3.678; B1 3.05,3.678; B4 2.25,3.678; B5 1.75,3.678; B6 0.75,3.678; B7 -0.75,3.678; B8 -1.75,3.678; B9 -2.25,3.678; B12 -3.05,3.678 | smd 2.18 x 2: MP1 -5.11,-0.827; MP2 5.11,-0.827; MP3 -5.11,3.103; MP4 5.11,3.103 | hole 0.65: -2.89,2.603; 2.89,2.603
JST04_1MM_RA = smd 0.6 x 1.35: 1 -1.5,0; 2 -0.5,0; 3 0.5,0; 4 1.5,0 | smd 1.2 x 2: NC1 2.8,-3.675; NC2 -2.8,-3.675
112ATAARR03ATTEND = smd 1.8 x 1.2: G1 10.6,10.4; G2 4.9,10.4; S1 7.75,10.4; S2 2.05,10.4 | smd 1.4 x 1.9: G3 13.6,-3.85; G4 0.45,-2.85 | smd 0.7 x 1.5: P1 8.8,0; P2 7.7,0.4; P3 6.6,0; P4 5.5,-0.2; P5 4.4,0; P6 3.3,-0.2; P7 2.2,0; P8 1.1,0
IND_4828-WE-TPC_WRE = smd 0.127 x 0.127: 1 -2.286,0; 2 2.286,0
ESP32_WROVER_SPARKFUN-IC-POWER_SOT23-5 = smd 0.55 x 1.2: 1 -0.95,-1.3; 2 0,-1.3; 3 0.95,-1.3; 4 0.95,1.3; 5 -0.95,1.3
ESP32C6_VARISTOR_CT/CN1812 = smd 1.5 x 3.6: 1 -2.25,0; 2 2.25,0
ESP32_WROVER_SPARKFUN-DISCRETESEMI_SOT23-3 = smd 0.8 x 0.9: 1 -0.95,-1; 2 0.95,-1; 3 0,1.1
SOT65P210X110-3N = smd 1.05 x 0.5: 1 -1.05,0.65; 2 -1.05,-0.65; 3 1.05,0
ESP32_WROVER_EAGLE-LTSPICE_R0402 = smd 0.7 x 0.9: 1 -0.65,0; 2 0.65,0
ESP32_WROVER_BME680_PSON80P300X300X100-8N = smd 1.016 x 0.5: 1 1.458,1.2; 2 1.458,0.4; 3 1.458,-0.4; 4 1.458,-1.2; 5 -1.458,-1.22; 6 -1.458,-0.4; 7 -1.458,0.4; 8 -1.458,1.2
SJ = smd 1.168 x 1.6: 1 -0.762,0; 2 0.762,0
TP20R = smd 2 x 2: TP 0,0
SON127P600X800X80-9N = smd 0.94 x 0.44: 1 -3.895,1.905; 2 -3.895,0.635; 3 -3.895,-0.635; 4 -3.895,-1.905; 5 3.895,-1.905; 6 3.895,-0.635; 7 3.895,0.635; 8 3.895,1.905 | smd 3.4 x 4.3: 9 0,0
XCVR_ESP32-C6-WROOM-1-N8 = smd 1.5 x 0.9: 1 -8.75,5.26; 2 -8.75,3.99; 3 -8.75,2.72; 4 -8.75,1.45; 5 -8.75,0.18; 6 -8.75,-1.09; 7 -8.75,-2.36; 8 -8.75,-3.63; 9 -8.75,-4.9; 10 -8.75,-6.17; 11 -8.75,-7.44; 12 -8.75,-8.71; 13 -8.75,-9.98; 14 -8.75,-11.25; 15 8.75,-11.25; 16 8.75,-9.98; 17 8.75,-8.71; 18 8.75,-7.44; 19 8.75,-6.17; 20 8.75,-4.9; 21 8.75,-3.63; 22 8.75,-2.36; 23 8.75,-1.09; 24 8.75,0.18; 25 8.75,1.45; 26 8.75,2.72; 27 8.75,3.99; 28 8.75,5.26 | smd 0.8 x 0.8: 29_1 -2.755,0.79; 29_2 -1.505,0.79; 29_3 -0.255,0.79; 29_4 -2.755,-0.46; 29_5 -1.505,-0.46; 29_6 -0.255,-0.46; 29_7 -2.755,-1.71; 29_8 -1.505,-1.71; 29_9 -0.255,-1.71
SOIC127P1032X265-16N = smd 2.05 x 0.59: 1 -4.655,4.445; 2 -4.655,3.175; 3 -4.655,1.905; 4 -4.655,0.635; 5 -4.655,-0.635; 6 -4.655,-1.905; 7 -4.655,-3.175; 8 -4.655,-4.445; 9 4.655,-4.445; 10 4.655,-3.175; 11 4.655,-1.905; 12 4.655,-0.635; 13 4.655,0.635; 14 4.655,1.905; 15 4.655,3.175; 16 4.655,4.445
SON50P200X200X80-9N = smd 0.76 x 0.27: 1 -0.985,0.75; 2 -0.985,0.25; 3 -0.985,-0.25; 4 -0.985,-0.75; 5 0.985,-0.75; 6 0.985,-0.25; 7 0.985,0.25; 8 0.985,0.75 | smd 0.9 x 1.3: 9 0,0

### Placement (x,y rotation side)
BOOT_BUTTON  48.57,107.28 180 top
C1  158.69,6.74 90 top
C1_BAT  123.9,49.79 0 top
C1_BAT1  124.77,37.58 180 top
C1_BAT2  135.61,40.45 90 top
C2  157.37,6.74 90 top
C2_BAT  135.01,51.74 90 top
C3  132.53,40.29 90 top
C4  75.28,25.5 90 top
C4_USB  157.01,50.66 90 top
C5  27.31,106.73 270 top
C5_USB  150.12,49.66 90 top
C6  45.33,106.73 270 top
C7  94.01,31.82 90 top
C8  87.6,49.82 180 top
C9  11.98,99.82 270 top
C10  67.19,106.73 270 top
C10_SUPERCAP  95.23,54.88 270 top
C_DELAY  51.41,101.58 90 top
CHANGE_BUTTON  63.79,107.28 180 top
CHG_LED  127.12,49.75 90 top
D1  153.72,49.98 0 top
D2  123.71,40.87 90 top
D3  90.23,31.06 180 top
D4  82.07,34.06 180 top
D5  89.91,27.06 0 top
D6  45.95,41.06 90 top
D7  88.36,65.87 0 top
D8  44.33,41.06 90 top
D9  32.71,51.06 90 top
D10  42.09,41.06 90 top
D11  75.47,22.06 0 top
D12  14.85,98.06 0 top
EPD_C1  92.23,21.66 90 top
EPD_C2  90.18,21.66 90 top
EPD_C5  88.12,21.5 90 top
EPD_C6  86.61,21.66 90 top
EPD_C7  84.56,21.66 90 top
EPD_C8  82.68,21.74 90 top
EPD_C9  80.79,21.74 90 top
EPD_C10  79.25,21.58 90 top
EPD_C11  72.2,18.58 90 top
EPD_C12  71.09,18.58 90 top
IC1  127.93,40.98 0 top
IC2  48.69,100.98 0 top
J1  86.01,13.88 0 top
J2  168.22,54.16 90 top
J3  164.56,19.32 90 top
J4  6.07,95.95 270 top
L1  82.47,29.05 270 top
MCP73831  130.88,48.88 90 top
PFMP.050.1  153.41,42 180 top
Q1  138.04,47.56 0 top
Q2  77.96,25.41 270 top
Q3  68.41,16.87 90 top
R1  19.49,42.9 270 top
R1-PINH  160.79,6.66 90 top
R1-PINH1  92.8,54.5 90 top
R1_BAT  127.12,47.79 0 top
R1_PWRUSB  121.87,40.5 90 top
R2  69.41,8.9 90 top
R2-PINH  159.74,6.66 90 top
R2-PINH1  92.64,62.5 90 top
R2-USB1  154.45,44.58 0 top
R2-USB2  154.29,46.58 0 top
R2_BAT  129.23,45.74 90 top
R3  66.93,9.82 0 top
R4  71.77,15.82 0 top
R5  30.69,50.82 90 top
R6  44.61,35.82 90 top
R7  73.53,25.82 90 top
R8  9.45,99.82 90 top
R9  47.37,35.82 90 top
R10  48.85,35.82 90 top
R_BOOT  51.68,106.66 270 top
R_CAPACITOR  88.64,63.82 180 top
R_CHANGE  60.74,106.5 270 top
R_CL1  81.61,24.74 180 top
R_RESET  20.96,106.5 270 top
RESET_BUTTIN  24.28,107.28 180 top
SENSOR2  159.15,12.53 90 top
SJ1  66.36,7.98 0 top
TP1  14.53,67.9 0 top
TP2  18.68,67.89 0 top
TP3  150.37,61.9 0 top
TP4  26.29,85.9 0 top
TP5  26.49,91.98 0 top
TP6  77.41,94.98 0 top
TP7  87.33,94.98 0 top
TP8  82.25,94.98 0 top
TP9  10.17,16.98 0 top
TP10  28.06,25.9 0 top
TP11  14.61,19.9 0 top
TP12  18.71,21.9 0 top
TP13  23.36,23.9 0 top
TP14  150.01,58.9 0 top
TP15  36.66,25.9 0 top
TP16  44.31,78.9 0 top
TP17  106.96,30.9 0 top
U1  36.47,56.56 0 top
U2  13.6,55.04 90 top
U3  84.95,57.1 270 top
U4  140.64,51.53 0 top

### Tracks (layer width: path | path; a pad name or v marks a point on that pad's centre or on a via)
3V3
  Top 0.3: 129.46,41.38 131.99,38.85 132.47,38.85 C3.+ 132.61,38.92 133.24,38.92 134.14,39.82 135.59,39.82 C1_BAT2.1 135.66,39.68 136.35,39.68 157.2,18.84 164.54,18.84 J3.2 | 129.46,41.38 129.36,41.48 129.36,41.9 IC1.5 | 18.73,106.61 12.6,100.48 12.12,100.48 C9.1 11.91,100.48 9.49,100.48 R8.2 9.35,100.48 8.86,100.48 8.59,100.2 8.59,92.24 6.86,90.51 5.89,90.51 J4.P4 | 18.73,106.61 19.32,107.2 20.91,107.2 R_RESET.1 | 47.99,101.04 47.3,101.04 IC2.2 47.16,101.04 24.31,101.04 18.73,106.61 | 47.99,101.04 49.17,102.21 49.17,102.35 52.01,105.19 52.28,105.19 52.56,105.47 52.56,106.92 | 52.56,106.92 52.28,107.2 51.8,107.2 51.73,107.27 R_BOOT.1 | R_CHANGE.1 60.73,107.2 52.91,107.2 52.7,106.99 52.56,106.92 | D7.2 89.47,65.86 89.68,65.65 90.51,65.65 92.59,63.57 92.59,63.16 R2-PINH1.2 92.45,63.09 91.96,63.09 90.65,61.77 90.65,61.15 89.82,60.32 88.16,60.32 | 92.1,55.19 92.8,55.19 R1-PINH1.2 | 92.1,55.19 88.16,59.14 88.16,60.32 | 88.16,60.32 88.16,61.7 U3.2 | U2.2 9.63,46.26 9.76,46.12 9.76,45.36 11.56,43.56 19.46,43.56 R1.1 19.6,43.56 26.73,43.56 31.82,48.65 | R_CL1.1 82.2,24.79 82.2,25.41 81.99,25.62 79.84,25.62 79.78,25.55 79.22,25.55 79.08,25.41 Q2.3 78.94,25.48 78.94,25.97 77.7,27.21 | 77.7,27.21 74.93,27.21 74.24,26.52 73.54,26.52 R7.2 73.41,26.52 59.42,26.52 49.58,36.36 48.89,36.36 R10.2 48.82,36.49 47.51,36.49 R9.2 47.37,36.49 44.67,36.49 R6.2 44.53,36.56 43.9,36.56 31.82,48.65 | 40.37,57.82 40.37,58.45 U1.8 | 40.37,57.82 U1.7 | 40.37,57.82 39.75,57.82 38.71,58.86 38.71,58.93 38.36,59.28 | 38.36,59.28 34.56,59.28 33.52,58.24 33.52,56.78 32.76,56.02 32.76,55.95 32.69,55.88 U1.3 32.55,55.88 32.34,55.88 31.51,55.05 31.51,53.25 30.68,52.42 30.68,51.52 R5.2 30.82,51.45 31.3,51.45 31.65,51.11 31.65,48.82 31.82,48.65
  Top 0.3: 38.36,59.28 38.43,59.42 38.5,59.49 38.5,72.3 44.25,78.05 44.25,78.88 TP16.TP 44.39,79.01 44.39,79.43 48.34,83.38 48.34,100.76 48.13,100.97 47.99,101.04 | 90.09,45.43 90.09,53.25 91.96,55.12 92.1,55.19 | 90.09,45.43 77.77,33.1 77.77,27.35 77.7,27.21 | 129.46,41.38 128.87,40.79 128.67,40.79 126.8,38.92 96.67,38.92 90.23,45.36 90.09,45.43
32KHZ  (via drill 0.3)
  Top 0.15: v91.48,61.84 92.59,61.84 R2-PINH1.1 | v90.09,61.84 89.47,61.84 89.4,61.77 U3.1 89.47,61.91 89.47,62.19 88.57,63.09 88.5,63.02 87.46,63.02 84.42,66.06 56.44,66.06 v46.05,55.68 | v20.5,48.96 18.56,47.02 18.56,46.33 U2.9 | v21.81,48.96 23.89,48.96 v29.98,55.05
  Bottom 0.15: v90.09,61.84 v91.48,61.84 | v21.81,48.96 v20.5,48.96 | v29.98,55.05 38.43,55.05 39.06,55.68 v46.05,55.68
DN  (via drill 0.3)
  Top 0.15: J2.A7 164.54,54.43 163.78,54.43 163.57,54.22 163.57,53.6 163.78,53.39 164.54,53.39 J2.B7 164.61,53.39 v165.51,53.39 | v158.17,49.03 154.98,49.03 D1.4
  Bottom 0.15: v158.17,49.03 161.15,49.03 v165.51,53.39
DP
  Top 0.15: 165.4,54.88 165.37,54.91 164.61,54.91 J2.B6 | 165.4,54.88 165.51,54.78 165.51,54.08 165.37,53.95 164.61,53.95 J2.A6 | 165.4,54.88 166.41,55.88 166.41,57.34 165.78,57.96 165.16,57.96 165.09,57.89 163.91,57.89 163.78,57.76 161.63,57.76 154.98,51.11 154.98,50.97 D1.6
EPD_3V3
  Top 0.3: J1.16 84.28,15.37 84.69,15.37 J1.15 84.83,15.44 84.83,15.51 84.62,15.72 84.62,15.86 84.76,16 84.76,16.48 87.22,18.94 | 87.22,18.94 88.09,19.8 88.09,20.84 EPD_C5.1 | 83.03,24.1 82.75,23.82 78.6,23.82 77.91,24.52 77.01,24.52 Q2.2 | 83.03,24.1 83.03,26.04 82.79,26.28 | 82.79,26.28 82.48,26.59 82.48,26.73 L1.2 | 82.79,26.28 84.48,27.98 90.65,27.98 93.14,30.47 93.14,30.89 93.42,31.16 93.97,31.16 C7.1 94.11,31.16 94.6,31.16 94.8,31.37 105.67,31.37 106.09,30.95 106.92,30.95 TP17.TP | 87.22,18.94 85.59,20.57 85.59,22.85 84.42,24.03 83.17,24.03 83.03,24.1
EPD_3V3_C  (via drill 0.3)
  Top 0.3: 77.18,25.73 77.91,25 78.05,25 78.46,24.58 80.81,24.58 80.95,24.72 R_CL1.2 | 77.18,25.73 77.01,25.9 77.01,26.32 Q2.1 | v21.05,47.51 21.05,63.78 U2.18 | v22.64,25.07 23.34,24.38 23.34,23.96 TP13.TP 23.48,23.96 24.24,23.96 24.31,24.03 75.9,24.03 76.17,24.31 76.17,24.58 76.11,24.65 76.11,25.07 76.31,25.28 76.73,25.28 77.18,25.73
  Bottom 0.3: v21.05,47.51 21.05,26.66 v22.64,25.07
EPD_BUSY  (via drill 0.3)
  Top 0.15: v87.12,16.14 87.53,16.14 87.81,15.86 87.81,15.79 87.74,15.72 87.74,15.37 J1.9 | v28.46,15.03 27.49,14.06 13.09,14.06 10.18,16.97 TP9.TP | v10.87,54.98 U2.26
  Bottom 0.15: v87.12,16.14 86.91,16.14 85.8,15.03 v28.46,15.03 28.46,15.1 20.64,22.92 20.64,37.53 10.87,47.3 v10.87,54.98
EPD_CS  (via drill 0.3)
  Top 0.15: v21.61,44.74 21.05,45.29 21.05,46.26 U2.11 | v27.42,27.15 28.05,26.52 28.05,25.97 TP10.TP 28.12,25.9 34.69,25.9 36.08,24.52 41.76,24.52 51.21,33.97 | v86.01,16.34 86.28,16.07 86.28,15.37 J1.12 | 51.21,33.97 50.69,34.49 47.78,34.49 47.44,34.83 47.44,35.11 R9.1 | 51.21,33.97 v51.66,33.52 | v53.18,33.52 53.18,33.66 46.54,40.3 45.98,40.3 D6.1
  Bottom 0.15: v21.61,44.74 21.61,32.96 v27.42,27.15 | v86.01,16.34 76.45,25.9 59.28,25.9 52.42,32.76 | v51.66,33.52 52.42,32.76 | 52.42,32.76 v53.18,33.52
EPD_DC  (via drill 0.3)
  Top 0.15: v85.73,14.54 86.63,14.54 86.77,14.68 86.77,15.3 J1.11 | v27.35,14.54 20.64,14.54 15.65,19.53 14.96,19.53 14.61,19.88 TP11.TP 14.61,19.94 14.61,21.12 v14.47,21.26 | v13.43,44.11 13.43,46.26 U2.5
  Bottom 0.15: v27.35,14.54 v85.73,14.54 | v13.43,44.11 13.43,22.3 v14.47,21.26
EPD_RST  (via drill 0.3)
  Top 0.15: v87.25,14.54 87.25,15.3 J1.10 | v30.05,14.06 22.23,21.88 18.77,21.88 TP12.TP 18.7,21.95 18.28,22.37 18.28,22.99 7.41,33.86 7.41,45.43 7.69,45.7 7.69,47.16 7.96,47.44 7.96,51.45 17.24,60.73 17.24,63.78 U2.21
  Bottom 0.15: v87.25,14.54 86.36,14.54 85.87,14.06 v30.05,14.06
FLASH_CS  (via drill 0.3)
  Top 0.15: 29.85,50.21 25.55,50.21 22.37,47.02 22.37,46.33 U2.12 | 29.85,50.21 30.68,50.21 R5.1 30.68,50.14 30.68,49.86 v31.09,49.44 | 29.85,50.21 29.85,52.15 30.47,52.77 30.47,57.06 31.86,58.45 32.55,58.45 U1.1 | v32.2,49.38 32.69,49.86 32.69,50.28 D9.1
  Bottom 0.15: v32.2,49.38 31.16,49.38 v31.09,49.44
GDR
  Top 0.15: J1.2 91.27,15.3 91.27,14.68 90.65,14.06 79.71,14.06 77.01,16.76 71.74,16.76 71.19,16.2 71.19,15.86 R4.1 71.12,16 70.64,16 69.94,16.69 68.63,16.69 68.42,16.48 68.42,16.34 67.93,15.86 67.8,15.86 Q3.1
GND  (18 unrouted)
  Top 0.15: U2.29_5 14.06,52.35 U2.29_4
  pour Top: 19.98,108.92 19.96,108.94 18.94,109.96 18.92,109.98 18.92,111.92 0.08,111.92 0.08,0.08 169.92,0.08 169.92,66.92 91.98,66.92 91.96,66.94 91.94,66.96 91.92,66.98 91.92,109.97 90.97,110.92 70.08,110.92 70.08,108.98 70.06,108.96 70.04,108.94 70.02,108.92
  pour Bottom: 169.04,65.94 169.02,65.92 91.98,65.92 91.96,65.94 91.94,65.96 91.92,65.98 91.92,110.92 0.08,110.92 0.08,0.08 169.92,0.08 169.92,66.82
GPIO8  (via drill 0.3)
  Top 0.15: v20.29,43 20.29,42.59 20.01,42.31 19.53,42.31 R1.2 | v20.22,45.15 19.8,45.57 19.8,46.26 U2.10
  Bottom 0.15: v20.29,43 20.29,45.08 v20.22,45.15
I2C_PW  (via drill 0.3)
  Top 0.3: R2-PINH.2 159.76,7.34 160.73,7.34 R1-PINH.2 | C2.1 157.41,6.09 158.65,6.09 C1.1 158.79,6.16 158.79,6.3 159.69,7.2 R2-PINH.2 | 158.48,12.91 158.79,13.23 158.79,13.92 SENSOR2.2 158.79,14.13 158.79,14.75 v158.65,14.89 | 158.48,12.91 157.89,12.33 157.89,11.63 157.96,11.56 SENSOR2.8 158.03,10.94 158.03,10.66 157.89,10.53 157.89,10.39 157.96,10.32 157.96,10.25 160.18,8.03 160.18,7.48 R2-PINH.2 | 158.48,12.91 159.55,11.84 SENSOR2.6 | v37.95,65.03 22.71,65.03 22.37,64.68 22.37,63.85 U2.17
  Bottom 0.3: v37.95,65.03 90.58,65.03 91.96,66.41 107.06,66.41 158.58,14.89 v158.65,14.89
INT_RTC  (via drill 0.3)
  Top 0.15: v88.71,59.35 89.89,59.35 93.63,55.61 93.63,54.15 93.35,53.88 92.86,53.88 R1-PINH1.1 92.8,53.81 92.8,53.53 v90.65,51.38 | v87.53,60.52 86.91,61.15 86.91,61.7 U3.3 | v18.07,44.46 17.24,45.29 17.24,46.26 U2.8 | v20.5,42.03 36.63,25.9 TP15.TP 36.7,25.9 42.45,25.9 v50.55,34
  Bottom 0.15: v87.53,60.52 v88.71,59.35 | v20.5,42.03 v18.07,44.46 | v90.65,51.38 89.96,51.38 72.57,34 v50.55,34
IO/BOOT  (via drill 0.3)
  Top 0.15: C6.1 45.36,107.41 46.26,107.41 46.81,107.96 BOOT_BUTTON.4 46.88,108.03 48.41,108.03 49.03,107.41 49.1,107.41 | 49.58,105.33 51.31,105.33 51.66,105.67 51.66,105.95 R_BOOT.2 | 49.58,105.33 49.1,105.81 49.1,107.41 | 49.1,107.41 49.65,107.96 50.28,107.96 BOOT_BUTTON.3 | v25.69,64.47 25.07,63.85 24.86,63.85 U2.15 | v49.51,105.19 49.58,105.26 49.58,105.33
  Bottom 0.15: v25.69,64.47 25.69,81.37 v49.51,105.19
IO/CHANGE  (via drill 0.3)
  Top 0.15: C10.1 67.17,107.41 66.76,107.41 66.48,107.68 65.86,107.68 65.58,107.96 CHANGE_BUTTON.3 65.51,108.03 63.92,108.03 63.29,107.41 63.23,107.41 | 63.23,107.41 63.23,105.81 62.53,105.12 61.15,105.12 60.8,105.47 60.8,105.81 R_CHANGE.2 60.73,105.75 60.11,105.75 v59.9,105.54 | 63.23,107.41 62.67,107.96 62.05,107.96 CHANGE_BUTTON.4 | v47.78,93.42 20.84,66.48 16.69,66.48 14.75,64.54 14.75,63.85 U2.23
  Bottom 0.15: v59.9,105.54 v47.78,93.42
MISO  (via drill 0.3)
  Top 0.15: 11.36,98.33 10.53,99.17 9.49,99.17 R8.1 | 11.36,98.33 13.85,98.33 14.06,98.13 D12.1 | v8.03,94.94 6.86,93.76 6.09,93.76 J4.P7 6.03,93.69 5.12,93.69 4.64,93.21 4.64,78.6 13.92,69.32 13.92,69.25 | v11.29,98.2 11.36,98.27 11.36,98.33 | v31.3,57.2 32.55,57.2 U1.2 | v20.98,67.52 19.25,69.25 13.92,69.25 | 13.92,69.25 9.9,65.23 9.9,64.13 9.63,63.85 U2.27 | v39.06,62.67 71.4,95.01 77.35,95.01 TP6.TP
  Bottom 0.15: v11.29,98.2 v8.03,94.94 | v20.98,67.52 v31.3,57.2 31.37,57.2 36.84,62.67 v39.06,62.67
MOSI  (via drill 0.3)
  Top 0.15: J1.14 85.25,15.3 85.25,14.68 85.04,14.47 80.05,14.47 75,19.53 75,21.74 74.72,22.02 D11.1 74.65,22.09 74.65,22.51 74.37,22.78 v74.37,22.92 | v74.37,24.58 74.37,24.79 74.03,25.14 73.54,25.14 R7.1 | v38.64,54.64 39.54,54.64 | 39.54,54.64 40.3,54.64 U1.5 | U2.7 16,46.33 16,47.02 v20.5,51.52 20.5,51.59 v18.91,53.18 | v7.2,88.99 6.86,89.33 6.09,89.33 J4.P3 | 39.54,54.64 39.54,56.23 39.82,56.51 40.86,56.51 80.68,96.33 82.82,96.33 84.14,95.01 87.32,95.01 TP7.TP
  Bottom 0.15: v74.37,22.92 v74.37,24.58 72.3,24.58 71.53,25.35 57.96,25.35 48.54,34.76 48.54,44.67 38.64,54.57 v38.64,54.64 30.19,54.64 27.08,51.52 v20.5,51.52 | v7.2,88.99 7.2,64.89 v18.91,53.18
N$1  (via drill 0.3)
  Top 0.15: v124.86,38.36 125.14,38.36 125.41,38.09 125.41,37.6 C1_BAT1.1 | D2.1 123.75,39.82 123.96,39.61 124.44,39.61 v124.58,39.47 124.65,39.47 125.2,40.03 125.62,40.03 | 125.62,40.03 IC1.3 | 125.62,40.03 125.62,41.55 125.97,41.9 126.52,41.9 IC1.1 126.59,41.97 127.14,41.97 128.81,43.63 136.49,43.63 138.99,46.12 138.99,46.54 Q1.2
  Bottom 0.15: v124.86,38.36 124.86,39.2 v124.58,39.47
N$2
  Top 0.15: R2-USB1.1 153.8,44.53 153.8,40.79 154.77,39.82 158.65,39.82 166.62,47.78 166.62,51.66 165.37,52.91 164.61,52.91 J2.A5
N$3  (via drill 0.3)
  Top 0.15: v77.97,17.17 79.78,15.37 80.19,15.37 J1.24 | v71.53,17.17 71.12,17.59 71.12,17.87 EPD_C12.1
  Bottom 0.15: v71.53,17.17 v77.97,17.17
N$4
  Top 0.15: IC2.5 50.14,101.87 50.14,101.66 50.69,101.11 51.24,101.11 51.38,100.97 C_DELAY.1
N$5  (via drill 0.3)
  Top 0.15: v76.11,26.38 76.11,25.62 75.34,24.86 C4.1 | v83.03,33.31 83.31,33.31 83.79,33.79 83.79,34 D4.1 83.86,33.86 84.55,33.86 87.32,31.09 88.43,31.09 D3.2
  Bottom 0.15: v83.03,33.31 v76.11,26.38
N$6
  Top 0.15: R1_BAT.1 126.52,47.78 126.52,47.23 126.8,46.95 128.25,46.95 128.6,47.3 128.6,48.34 128.81,48.54 130.81,48.54 131.44,47.92 132.13,47.92 MCP73831.1
N$7  (via drill 0.3)
  Top 0.15: v126.38,50.55 126.38,49.79 CHG_LED.C | v127.97,48.61 127.97,48.48 127.91,48.41 127.91,47.92 127.83,47.85 R1_BAT.2
  Bottom 0.15: v126.38,50.55 126.38,50.21 v127.97,48.61
N$8  (via drill 0.3)
  Top 0.15: v162.6,52.84 156.37,46.6 154.98,46.6 R2-USB2.2 | v165.51,55.75 165.37,55.88 164.61,55.88 J2.B5
  Bottom 0.15: v165.51,55.75 v162.6,52.84
N$9
  Top 0.15: R2_BAT.2 129.22,47.37 129.64,47.78 129.64,47.92 MCP73831.5
N$10
  Top 0.15: J1.22 81.23,15.37 81.23,18.63 79.22,20.64 79.22,20.91 EPD_C10.1
N$12
  Top 0.15: J1.20 82.27,15.37 82.27,20.36 82.68,20.77 82.68,21.05 EPD_C8.1
N$13
  Top 0.15: J1.19 82.75,15.37 82.75,18.91 84.55,20.71 84.55,20.98 EPD_C7.1
N$14  (via drill 0.3)
  Top 0.15: v85.87,19.53 83.17,16.83 83.17,16 83.31,15.86 83.31,15.79 83.24,15.72 83.24,15.37 J1.18 | v86.63,20.29 86.63,20.98 EPD_C6.1
  Bottom 0.15: v86.63,20.29 v85.87,19.53
N$16
  Top 0.15: J1.4 90.23,15.37 90.23,18.7 92.24,20.71 92.24,20.98 EPD_C1.1
N$17
  Top 0.15: J1.5 89.75,15.37 89.75,20.29 90.16,20.71 90.16,20.98 EPD_C2.1
N$22
  Top 0.15: D7.1 87.32,65.86 87.74,65.86 89.19,64.4 89.19,63.92 89.26,63.85 R_CAPACITOR.1
PREVGH  (via drill 0.3)
  Top 0.15: J1.21 81.78,15.37 81.78,19.8 80.81,20.77 80.81,21.05 EPD_C9.1 80.88,21.05 81.23,21.05 v81.65,21.47 | v84.76,24.45 87.32,27.01 88.16,27.01 D5.1
  Bottom 0.15: v84.76,24.45 84.62,24.45 v81.65,21.47
PREVGL  (via drill 0.3)
  Top 0.15: v77.49,17.66 78.32,17.66 | 78.32,17.66 79.08,17.66 80.75,16 80.75,15.37 J1.23 | v73.06,17.66 72.92,17.8 72.3,17.8 72.23,17.87 EPD_C11.1 | v79.43,26.25 79.43,31.92 80.33,32.83 80.33,34 D4.2 | v81.58,22.92 81.51,22.85 81.44,22.85 81.3,22.99 80.26,22.99 80.12,23.13 78.67,23.13 78.32,22.78 78.32,17.66
  Bottom 0.15: v73.06,17.66 v77.49,17.66 | v79.43,26.25 79.43,25.07 v81.58,22.92
RESE
  Top 0.15: 70.08,14.89 78.46,14.89 79.78,13.57 91.06,13.57 92.24,14.75 92.24,15.93 92.03,16.14 90.92,16.14 90.79,16 90.79,15.37 J1.3 | 70.08,14.89 69.11,15.86 Q3.2 | R3.1 66.34,9.83 66.34,11.08 70.08,14.82 70.08,14.89
RESE'
  Top 0.15: SJ1.2 67.17,8.03 67.52,8.38 67.52,9.76 R3.2 67.59,9.56 69.39,9.56 R2.2
RESET  (via drill 0.3)
  Top 0.15: 23.75,107.34 23.75,105.81 23.48,105.54 21.47,105.54 21.19,105.81 20.98,105.81 R_RESET.2 | 23.75,107.34 23.13,107.96 22.58,107.96 RESET_BUTTIN.4 | 33.24,101.94 47.23,101.94 IC2.1 | 33.24,101.94 27.91,107.27 27.42,107.27 27.35,107.34 C5.1 27.29,107.41 26.59,107.41 26.04,107.96 RESET_BUTTIN.3 25.97,107.96 25.41,107.96 24.79,107.34 23.75,107.34 | v20.5,62.67 20.5,56.02 15.86,51.38 15.3,51.38 10.94,47.02 10.94,46.33 U2.3 | v33.17,101.8 33.24,101.87 33.24,101.94
  Bottom 0.15: v20.5,62.67 20.5,89.12 v33.17,101.8
RTC_RST  (via drill 0.3)
  Top 0.15: v34.35,64.47 32.55,62.67 24.03,62.67 23.61,63.09 23.61,63.78 U2.16 | v82.27,65.58 85.52,62.33 85.52,61.77 U3.4
  Bottom 0.15: v34.35,64.47 36.29,66.41 81.44,66.41 v82.27,65.58
RX
  Top 0.15: U2.24 13.43,63.85 13.43,64.47 16.34,67.38 17.52,67.38 17.66,67.52 18.28,67.52 18.63,67.86 TP2.TP
SCK  (via drill 0.3)
  Top 0.15: v85.39,16.34 85.73,16 85.73,15.37 J1.13 | v49.93,34 46.26,34 45.22,35.04 44.74,35.04 44.67,35.11 R6.1 44.6,35.18 44.11,35.18 39.82,39.47 v39.82,39.89 | 41.2,54.98 40.93,55.26 40.86,55.26 40.37,55.75 40.37,55.88 U1.6 | 41.2,44.53 41.2,42.59 41.13,42.52 41.13,40.86 41.69,40.3 42.03,40.3 D10.1 | 41.2,44.53 41.2,54.98 | v26.94,44.53 26.66,44.25 18.91,44.25 18.63,43.97 16.34,43.97 14.75,45.57 14.75,46.26 U2.6 | v41.06,44.53 41.2,44.53 | v7.2,91.62 7.13,91.55 6.09,91.55 J4.P5 | 41.2,54.98 41.62,54.98 81.58,94.94 82.2,94.94 TP8.TP
  Bottom 0.15: v85.39,16.34 83.24,16.34 73.96,25.62 58.31,25.62 v49.93,34 | v41.06,44.53 39.82,44.53 | 39.82,44.53 v26.94,44.53 26.87,44.53 20.01,51.38 20.01,76.8 7.2,89.61 v7.2,91.62 | 39.82,44.53 v39.82,39.89
SCL  (via drill 0.3)
  Top 0.15: 159.62,15.37 157.96,15.37 156.44,13.85 156.44,5.75 156.92,5.26 159.28,5.26 159.69,5.68 159.69,5.96 R2-PINH.1 | 159.62,15.37 160.31,14.68 160.31,13.99 SENSOR2.4 | 143.94,50.17 149.58,44.53 v149.58,35.8 | 143.94,50.17 142.31,51.8 142.24,51.73 142.03,51.73 141.96,51.8 141.69,51.8 U4.7 | v163.84,21.54 164.54,20.84 J3.4 | v159.62,15.44 159.62,15.37 | v36.42,65.93 19.94,65.93 18.56,64.54 18.56,63.85 U2.20 | v88.71,53.67 89.33,53.05 89.33,52.49 U3.16 | 143.94,50.17 137.05,43.28 129.08,43.28 v128.94,43.14
  Bottom 0.15: v149.58,35.8 v163.84,21.54 163.84,21.47 159.62,17.24 v159.62,15.44 | v36.42,65.93 48.68,53.67 v88.71,53.67 88.78,53.67 91.55,56.44 94.25,56.44 107.55,43.14 v128.94,43.14
SDA  (via drill 0.3)
  Top 0.15: 160.62,12.22 159.55,13.3 159.55,13.92 SENSOR2.3 | 160.62,12.22 161.63,11.22 161.63,6.37 161.28,6.03 160.8,6.03 R1-PINH.1 | 142.34,52.25 150.06,44.53 150.06,33.52 163.71,19.88 164.54,19.88 J3.3 164.61,19.8 164.75,19.67 165.3,19.67 165.72,19.25 165.72,17.31 160.62,12.22 | 142.34,52.25 142.24,52.35 142.1,52.35 142.03,52.28 141.69,52.28 U4.8 | v37.67,65.58 37.53,65.44 20.71,65.44 19.8,64.54 19.8,63.85 U2.19 | v74.93,65.58 86.7,53.81 87.25,53.81 88.09,52.98 88.09,52.49 U3.15 87.95,53.18 88.22,53.46 88.22,53.81 v88.71,54.29 | v107.75,66.48 102.08,60.8 v95.22,60.8 | v142.38,52.28 142.34,52.25
  Bottom 0.15: v74.93,65.58 v37.67,65.58 | v142.38,52.28 142.38,53.25 129.15,66.48 v107.75,66.48 | v88.71,54.29 v95.22,60.8
SRC  (via drill 0.3)
  Top 0.15: v89.12,27.08 91.62,27.08 D5.2 | v86.04,31.16 82.61,31.16 82.48,31.3 L1.1 | v71.67,24.58 72.92,25.83 72.99,25.76 74.1,25.76 74.51,26.18 75.28,26.18 C4.2 | v68.63,18.84 68.42,18.63 68.42,17.94 Q3.3
  Bottom 0.15: v86.04,31.16 89.12,28.08 v89.12,27.08 89.12,18.77 86.22,15.86 80.33,15.86 74.31,21.88 71.67,21.88 | 71.67,21.88 v71.67,24.58 | v68.63,18.84 71.67,21.88
SS_SD  (via drill 0.3)
  Top 0.15: v48.06,35.8 48.2,35.8 48.82,35.18 R10.1 | v44.46,39.4 44.46,40.23 44.39,40.3 D8.1 | v16.34,47.99 13.16,47.99 12.19,47.02 12.19,46.33 U2.4 | v14.13,69.73 14.13,81.37 7.27,88.22 6.51,88.22 J4.P2
  Bottom 0.15: v48.06,35.8 v44.46,39.4 31.44,39.4 22.85,47.99 19.39,47.99 | 19.39,47.99 v16.34,47.99 | v14.13,69.73 14.13,58.59 19.39,53.32 19.39,47.99
TX
  Top 0.15: U2.25 12.19,63.85 12.19,64.75 14.47,67.03 14.47,67.86 TP1.TP
USB_D+  (via drill 0.3)
  Top 0.15: v153.53,49.86 153.53,50.55 153.18,50.9 152.49,50.9 D1.1 | v91.83,51.11 v123.13,51.11 | v41.69,48.27 v87.46,48.27 | v25.69,47.02 25,46.33 24.86,46.33 U2.14
  Bottom 0.15: v153.53,49.86 127.7,49.86 126.45,51.11 v123.13,51.11 | v91.83,51.11 88.99,48.27 v87.46,48.27 | v41.69,48.27 26.94,48.27 v25.69,47.02
USB_D-  (via drill 0.3)
  Top 0.15: v151.73,48.2 152.42,48.89 152.42,49.03 D1.3 | v90.65,50.62 v123.61,50.62 | v41.69,48.89 v88.09,48.89 | v24.31,47.71 23.61,47.02 23.61,46.33 U2.13
  Bottom 0.15: v151.73,48.2 128.18,48.2 128.11,48.13 126.1,48.13 v123.61,50.62 | v90.65,50.62 89.82,50.62 v88.09,48.89 | v41.69,48.89 25.48,48.89 v24.31,47.71
VBAT  (via drill 0.3)
  Top 0.3: U4.2 139.68,51.73 139.68,51.31 U4.3 139.54,51.24 139.19,51.24 139.12,51.18 139.05,51.18 138.92,51.31 | 136.66,49.06 136.91,48.82 137.88,48.82 138.01,48.68 Q1.3 137.95,48.54 137.95,45.98 137.67,45.7 136.49,45.7 136.28,45.91 136.28,46.54 132.96,49.86 132.2,49.86 MCP73831.3 | 136.66,49.06 135.04,50.69 135.04,51.04 C2_BAT.1 | 136.66,49.06 138.92,51.31 | v141.13,53.88 141.55,53.88 149.51,61.84 150.34,61.84 TP3.TP | v138.92,51.52 138.92,51.31
  Bottom 0.3: v141.13,53.88 141.13,53.74 v138.92,51.52
VBUS
  Top 0.3: R1_PWRUSB.2 121.88,41.2 122.5,41.2 123.13,41.83 123.61,41.83 123.68,41.9 D2.2 123.68,42.03 123.68,48.75 | 123.68,48.75 123.27,49.17 123.27,49.79 C1_BAT.1 | 123.68,48.75 127.35,48.75 127.77,49.17 127.77,49.65 CHG_LED.A 127.91,49.79 129.57,49.79 MCP73831.4 129.71,49.86 130.47,49.86 131.16,50.55 133.65,50.55 | 133.65,50.55 137.05,47.16 137.05,46.6 Q1.1 | 150.86,50.45 151.45,51.04 151.45,51.38 151.73,51.66 | 150.86,50.45 150.76,50.34 150.13,50.34 C5_USB.2 150,50.34 149.51,50.34 146.53,53.32 134.34,53.32 133.72,52.7 133.72,50.69 133.65,50.55 | 151.73,51.66 153.25,51.66 153.94,50.97 153.94,50.21 154.22,49.93 154.91,49.93 D1.5 155.05,49.93 155.74,49.93 156.02,50.21 156.02,50.9 156.37,51.24 156.99,51.24 C4_USB.2 | TP14.TP 150.06,58.86 150.06,58.03 151.66,56.44 151.66,51.8 151.73,51.66 | 150.86,50.45 151.17,50.14 151.17,42.03 PFMP.050.1.2
VRTC  (via drill 0.3)
  Top 0.15: 88.05,50.66 86.91,51.8 86.91,52.42 U3.14 | 88.05,50.66 88.22,50.48 88.22,49.86 C8.1 | R_CAPACITOR.2 87.95,63.85 87.67,63.85 86.56,64.96 86.56,66.48 86.77,66.69 90.37,66.69 94.73,62.33 94.73,56.51 95.22,56.02 C10_SUPERCAP.1 94.73,56.44 94.25,55.95 v94.11,55.95 | v88.09,50.69 88.05,50.66
  Bottom 0.15: v88.09,50.69 88.85,50.69 v94.11,55.95
VUSB
  Top 0.3: J2.A4 164.54,51.66 164.54,51.87 J2.B9 164.4,51.8 163.71,51.8 | J2.A9 164.54,56.65 164.54,56.44 J2.B4 164.4,56.51 163.71,56.51 163.15,55.95 163.15,52.35 163.71,51.8 | 163.71,51.8 163.57,51.73 156.16,44.32 156.16,42.52 155.67,42.03 PFMP.050.1.1